# Altium project ADAS_ECU_revA.PrjPcb (part 2 of 6)

## Sheet JETSON_V2.SchDoc
size D; SheetNumber: 7; SheetTotal: 19
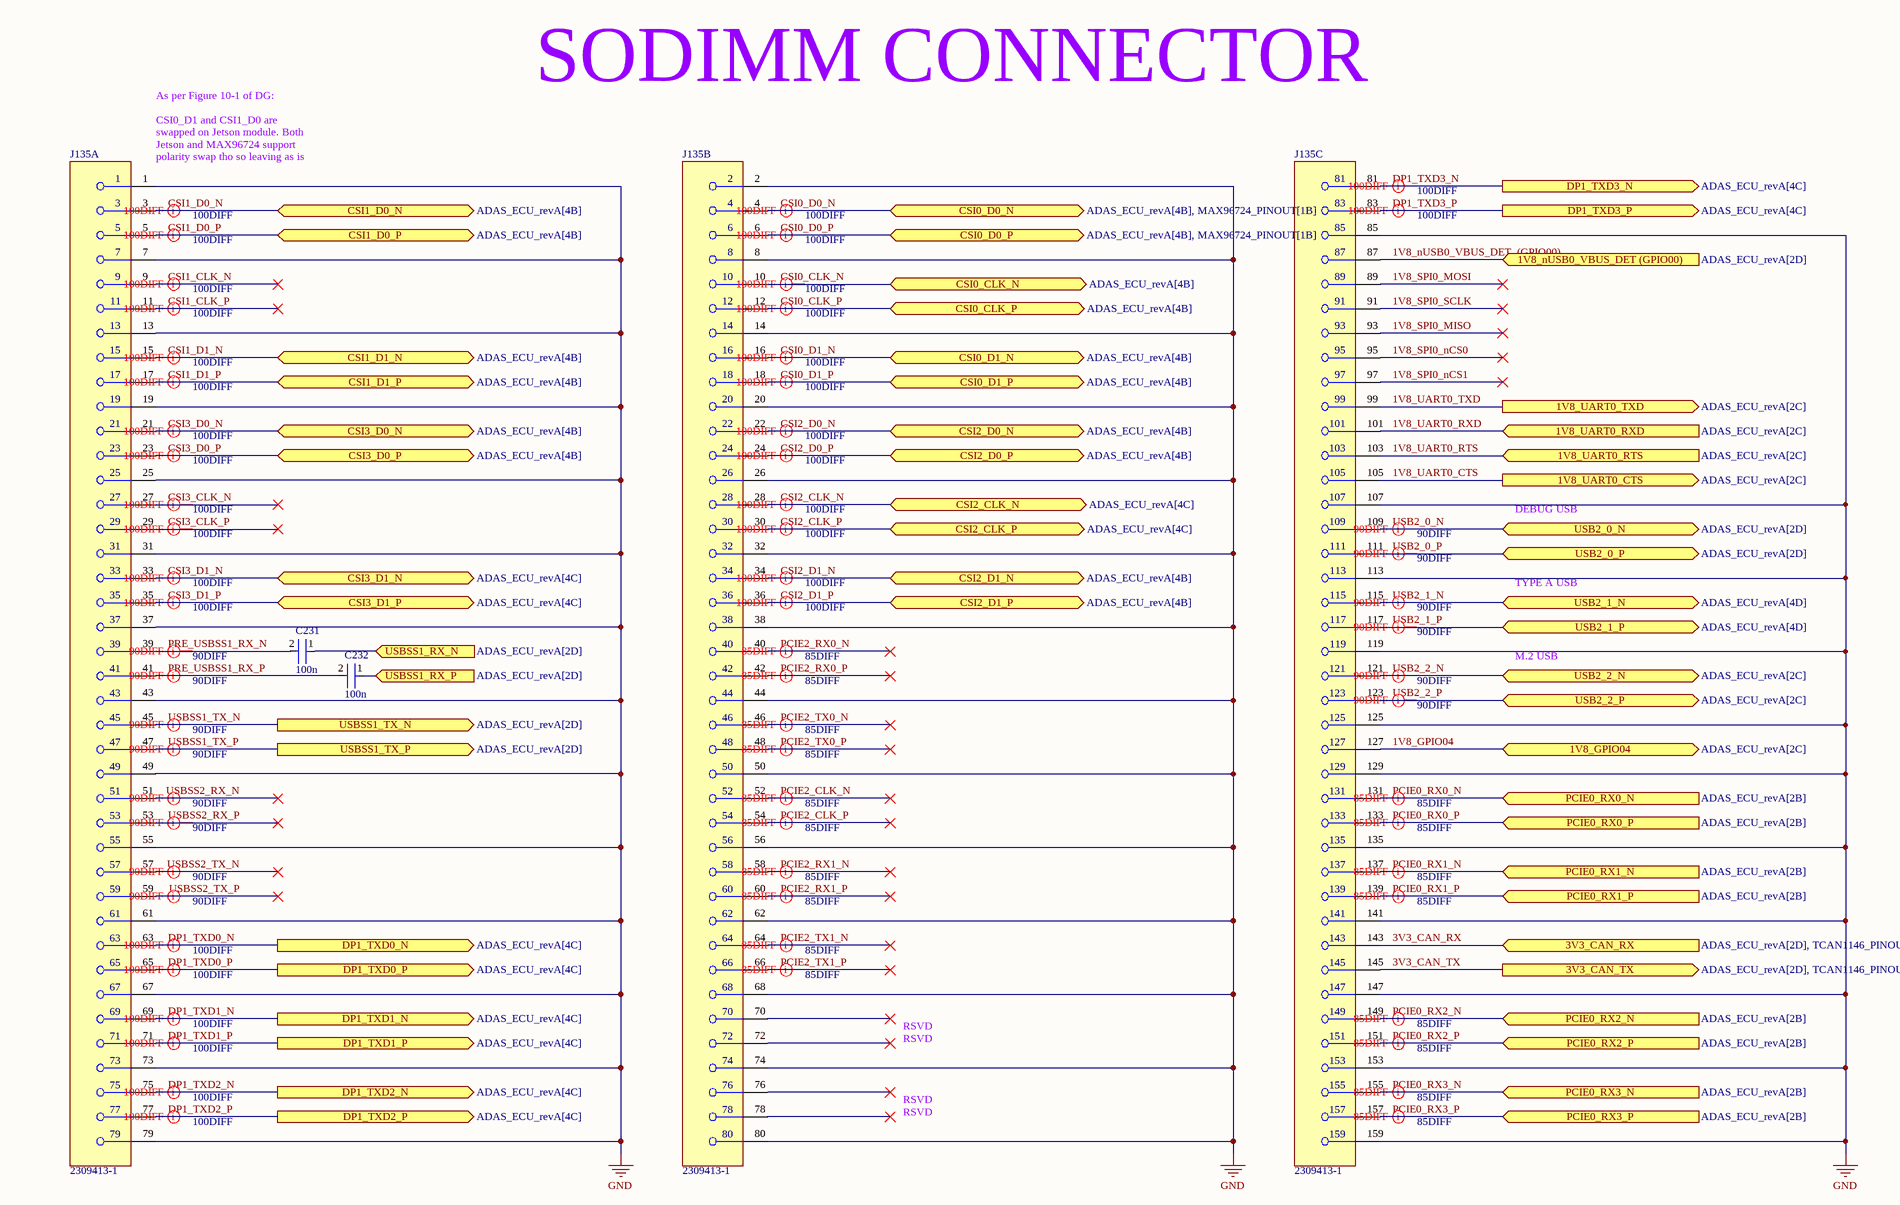
[diagram p12: JETSON_V2.SchDoc, top left]
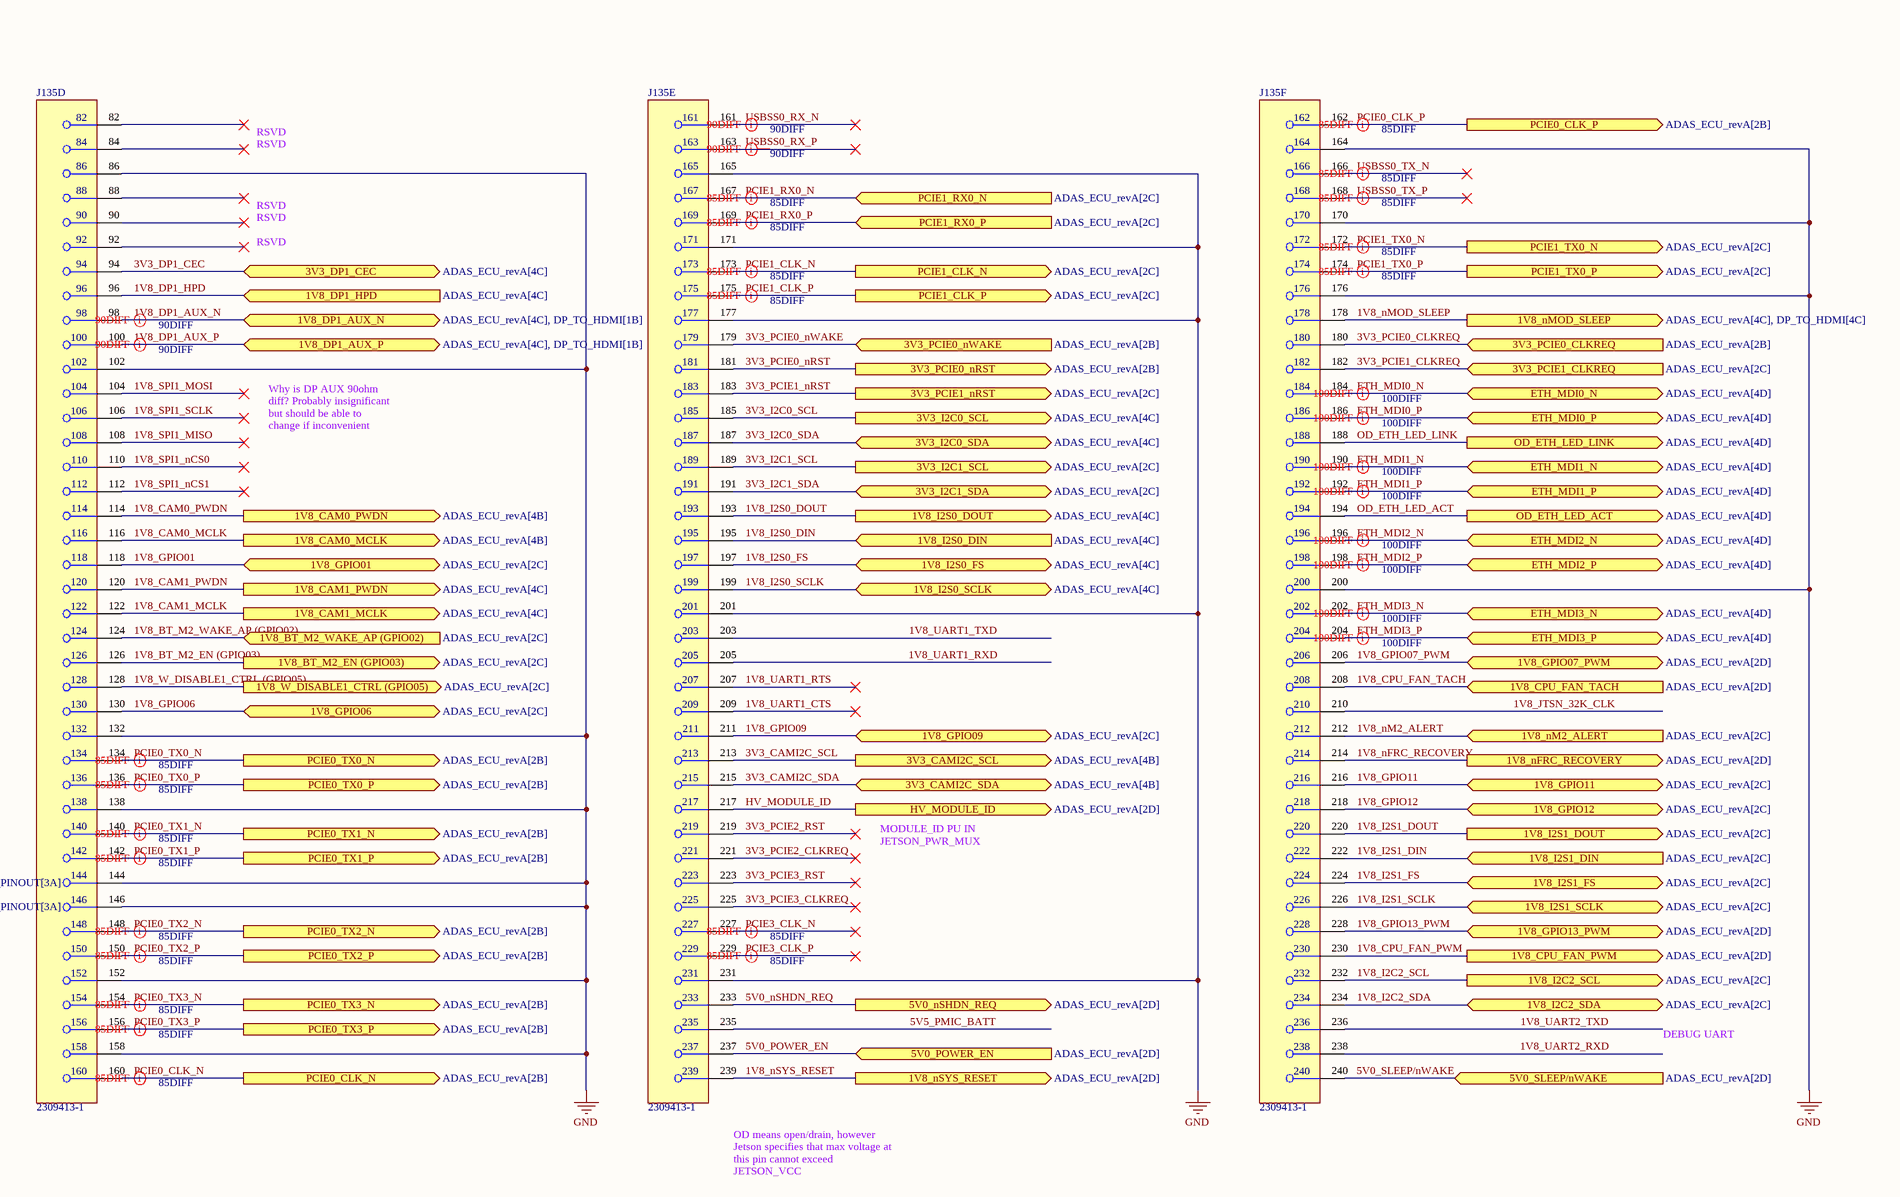
[diagram p13: JETSON_V2.SchDoc, top right]
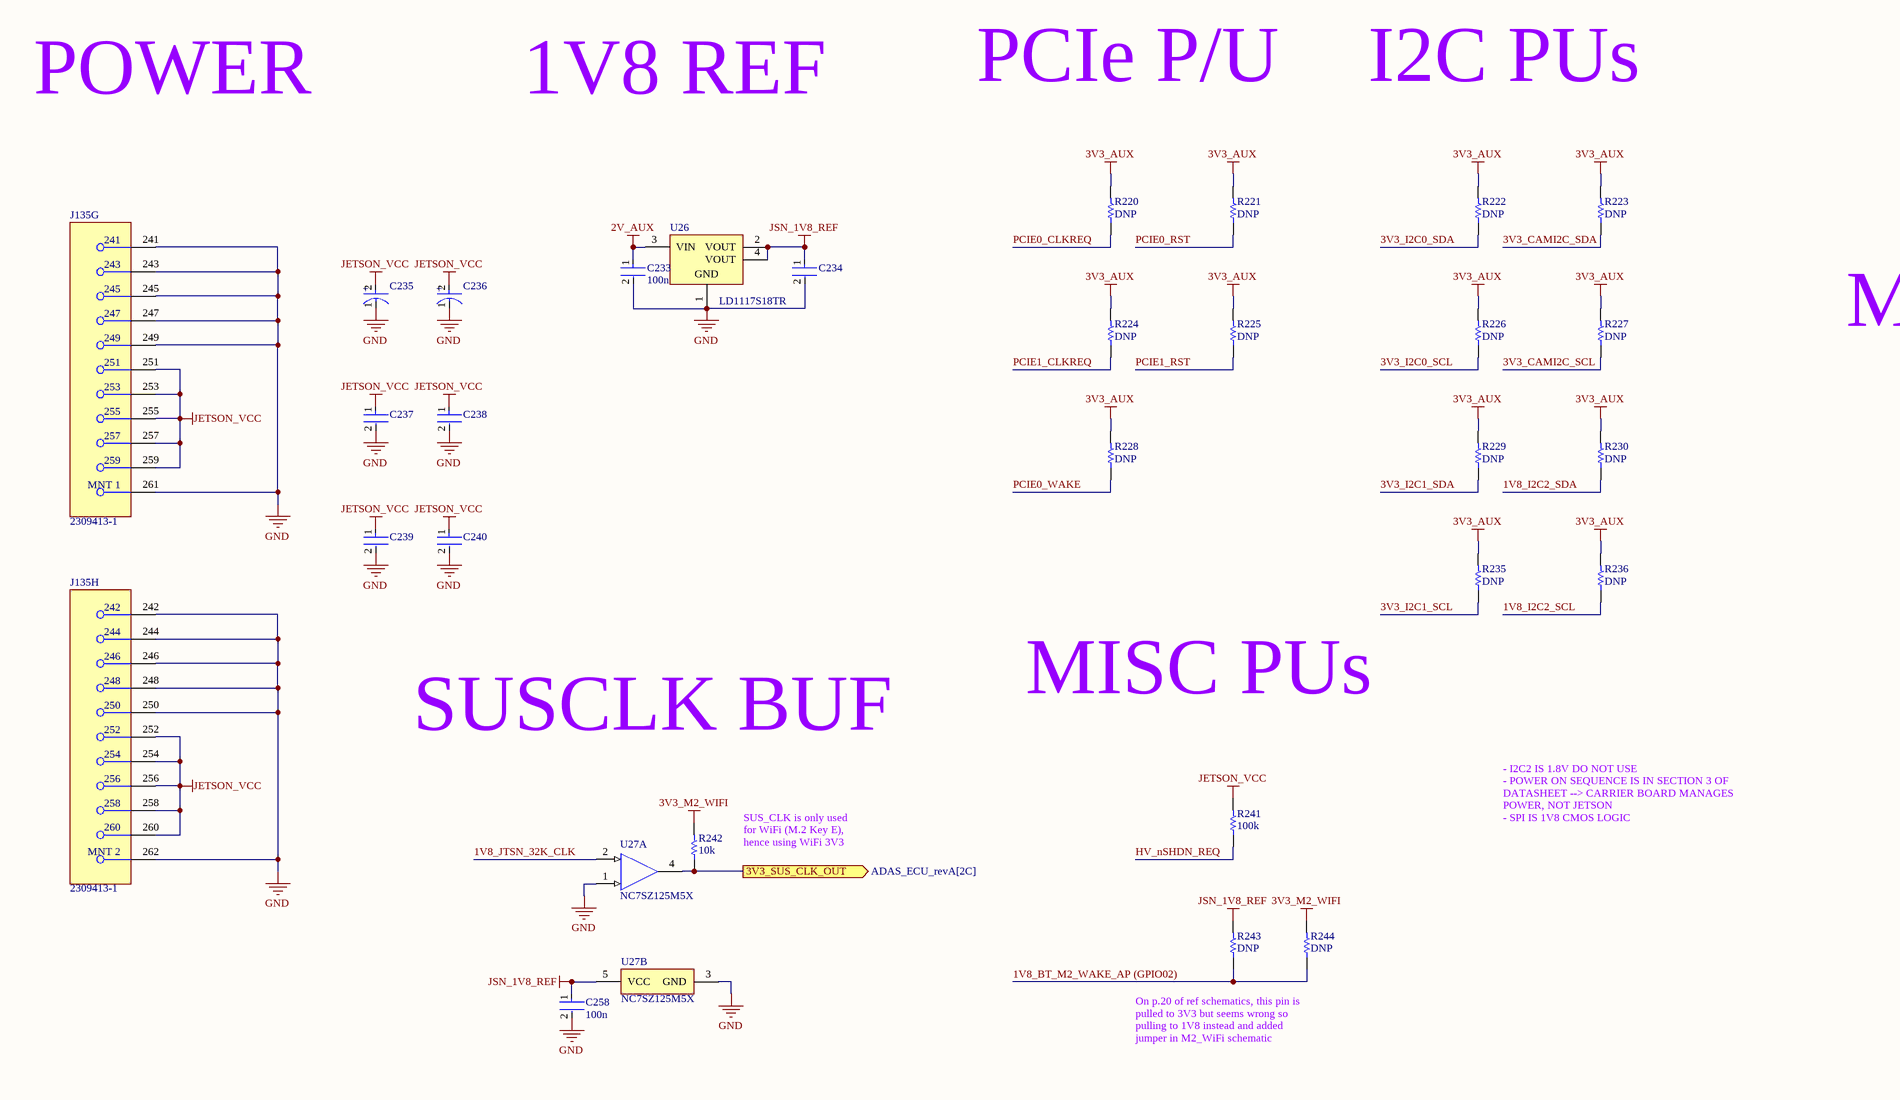
[diagram p14: JETSON_V2.SchDoc, bottom left]
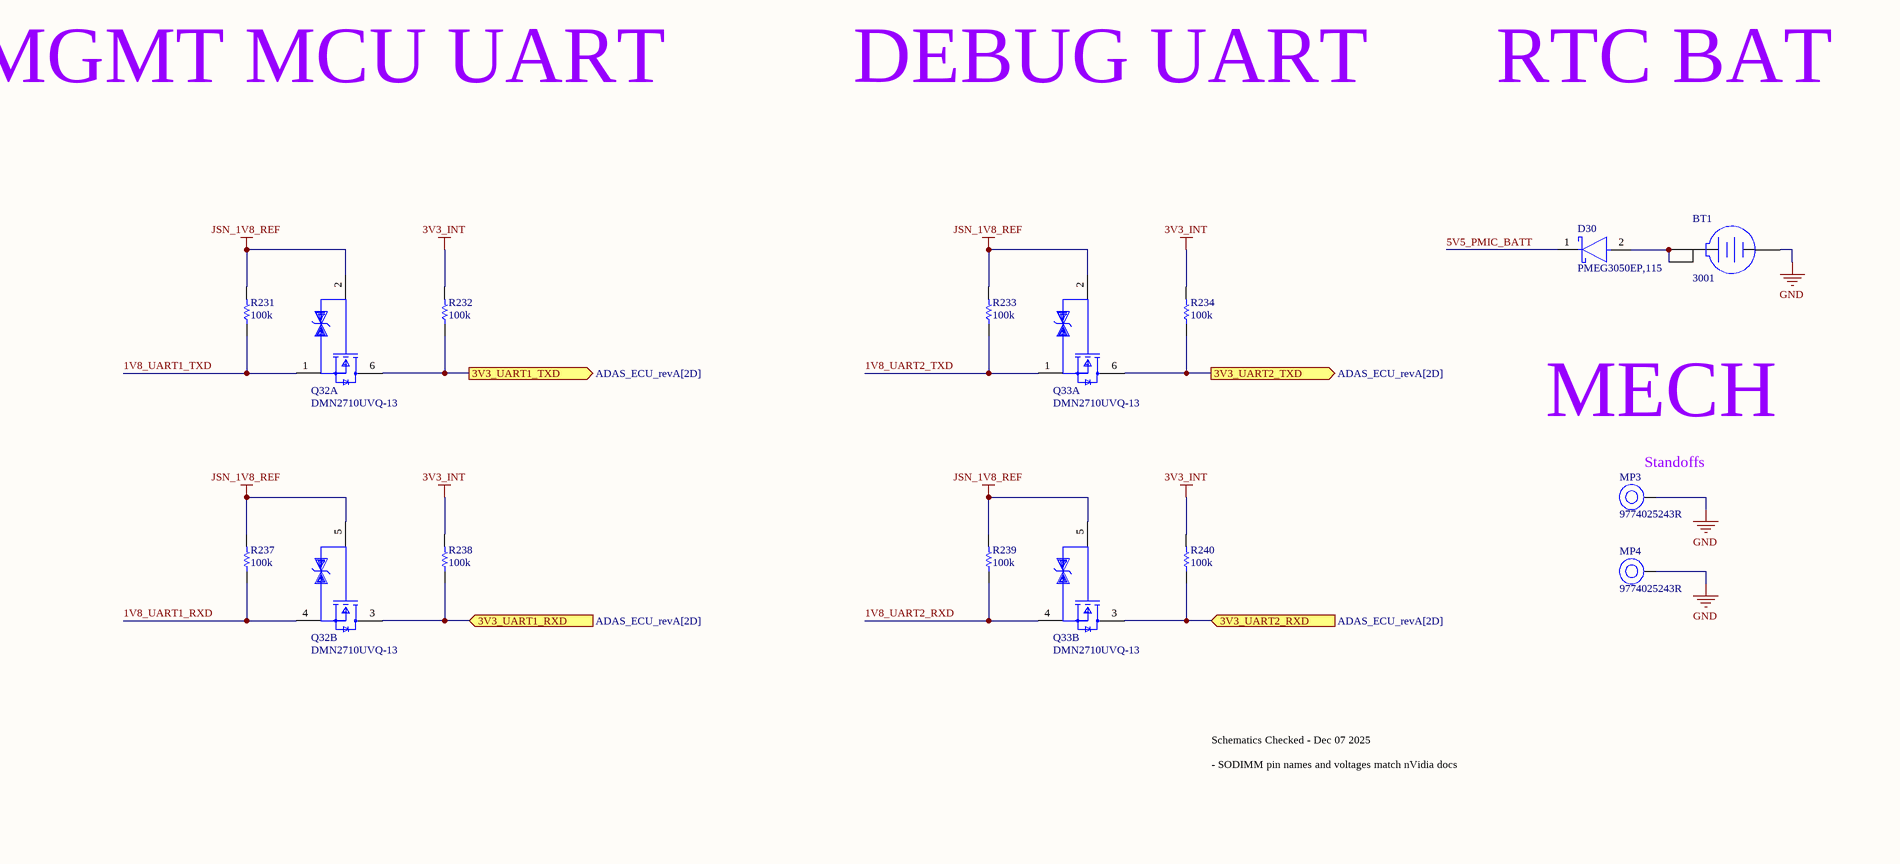
[diagram p15: JETSON_V2.SchDoc, bottom right]

### Parts
BT1  3001  [KSTN-3001_V]
C231  100n  [FP-0402-L_1_0_0_05-W_0_5-IPC_A]
C232  100n  [FP-0402-L_1_0_0_05-W_0_5-IPC_A]
C233  100n  [FP-0402-L_1_0_0_05-W_0_5-IPC_A]
C234  GRM188R60J106ME47D  [FP-GRM188-0_1-e0_2_0_55-IPC_A]  (value not drawn)
C235  T491X107K025AT  [FP-T491X107K025AT-MFG]  (value not drawn)
C236  T491X107K025AT  [FP-T491X107K025AT-MFG]  (value not drawn)
C237  12103D106KAT2A  [FP-1210-L_3_3_0_4-W_2_5_0-MFG]  (value not drawn)
C238  12103D106KAT2A  [FP-1210-L_3_3_0_4-W_2_5_0-MFG]  (value not drawn)
C239  12103D106KAT2A  [FP-1210-L_3_3_0_4-W_2_5_0-MFG]  (value not drawn)
C240  12103D106KAT2A  [FP-1210-L_3_3_0_4-W_2_5_0-MFG]  (value not drawn)
C258  100n  [FP-0402-L_1_0_0_05-W_0_5-IPC_A]
D30  PMEG3050EP,115  [FP-SOD128-MFG]
J135  2309413-1  [FP-2309413-1-MFG]  (parts A,B,C,D,E,F,G,H of 8)
MP3  9774025243R  [9774025243]
MP4  9774025243R  [9774025243]
Q32  DMN2710UVQ-13  [SOTFL50P162X60-6N]  (parts A,B of 2)
Q33  DMN2710UVQ-13  [SOTFL50P162X60-6N]  (parts A,B of 2)
R220  DNP  [R0603B]
R221  DNP  [R0603B]
R222  DNP  [R0603B]
R223  DNP  [R0603B]
R224  DNP  [R0603B]
R225  DNP  [R0603B]
R226  DNP  [R0603B]
R227  DNP  [R0603B]
R228  DNP  [R0603B]
R229  DNP  [R0603B]
R230  DNP  [R0603B]
R231  100k  [R0603B]
R232  100k  [R0603B]
R233  100k  [R0603B]
R234  100k  [R0603B]
R235  DNP  [R0603B]
R236  DNP  [R0603B]
R237  100k  [R0603B]
R238  100k  [R0603B]
R239  100k  [R0603B]
R240  100k  [R0603B]
R241  100k  [R0603B]
R242  10k  [R0603B]
R243  DNP  [R0603B]
R244  DNP  [R0603B]
U26  LD1117S18TR  [SOT-223_M]
U27  NC7SZ125M5X  [FAIR-SOT23-5_V]  (parts A,B of 2)

### Ports
1V8_BT_M2_EN (GPIO03) (out, see ADAS_ECU_revA[2C]), 1V8_BT_M2_WAKE_AP (GPIO02) (in, see ADAS_ECU_revA[2C]), 1V8_CAM0_MCLK (out, see ADAS_ECU_revA[4B]), 1V8_CAM0_PWDN (out, see ADAS_ECU_revA[4B]), 1V8_CAM1_MCLK (out, see ADAS_ECU_revA[4C]), 1V8_CAM1_PWDN (out, see ADAS_ECU_revA[4C]), 1V8_CPU_FAN_PWM (out, see ADAS_ECU_revA[2D]), 1V8_CPU_FAN_TACH (in, see ADAS_ECU_revA[2D]), 1V8_DP1_AUX_N (bidir, see ADAS_ECU_revA[4C], DP_TO_HDMI[1B]), 1V8_DP1_AUX_P (bidir, see ADAS_ECU_revA[4C], DP_TO_HDMI[1B]), 1V8_DP1_HPD (in, see ADAS_ECU_revA[4C]), 1V8_GPIO01 (bidir, see ADAS_ECU_revA[2C]), 1V8_GPIO04 (bidir, see ADAS_ECU_revA[2C]), 1V8_GPIO06 (bidir, see ADAS_ECU_revA[2C]), 1V8_GPIO07_PWM (bidir, see ADAS_ECU_revA[2D]), 1V8_GPIO09 (bidir, see ADAS_ECU_revA[2C]), 1V8_GPIO11 (bidir, see ADAS_ECU_revA[2C]), 1V8_GPIO12 (bidir, see ADAS_ECU_revA[2C]), 1V8_GPIO13_PWM (bidir, see ADAS_ECU_revA[2D]), 1V8_I2C2_SCL (out, see ADAS_ECU_revA[2C]), 1V8_I2C2_SDA (bidir, see ADAS_ECU_revA[2C]), 1V8_I2S0_DIN (in, see ADAS_ECU_revA[4C]), 1V8_I2S0_DOUT (out, see ADAS_ECU_revA[4C]), 1V8_I2S0_FS (bidir, see ADAS_ECU_revA[4C]), 1V8_I2S0_SCLK (bidir, see ADAS_ECU_revA[4C]), 1V8_I2S1_DIN (in, see ADAS_ECU_revA[2C]), 1V8_I2S1_DOUT (out, see ADAS_ECU_revA[2C]), 1V8_I2S1_FS (bidir, see ADAS_ECU_revA[2C]), 1V8_I2S1_SCLK (bidir, see ADAS_ECU_revA[2C]), 1V8_nFRC_RECOVERY (out, see ADAS_ECU_revA[2D]), 1V8_nM2_ALERT (in, see ADAS_ECU_revA[2C]), 1V8_nMOD_SLEEP (out, see ADAS_ECU_revA[4C], DP_TO_HDMI[4C]), 1V8_nSYS_RESET (out, see ADAS_ECU_revA[2D]), 1V8_nUSB0_VBUS_DET (GPIO00) (in, see ADAS_ECU_revA[2D]), 1V8_UART0_CTS (out, see ADAS_ECU_revA[2C]), 1V8_UART0_RTS (in, see ADAS_ECU_revA[2C]), 1V8_UART0_RXD (in, see ADAS_ECU_revA[2C]), 1V8_UART0_TXD (out, see ADAS_ECU_revA[2C]), 1V8_W_DISABLE1_CTRL (GPIO05) (out, see ADAS_ECU_revA[2C]), 3V3_CAMI2C_SCL (out, see ADAS_ECU_revA[4B]), 3V3_CAMI2C_SDA (bidir, see ADAS_ECU_revA[4B]), 3V3_CAN_RX (in, see ADAS_ECU_revA[2D], TCAN1146_PINOUT[3A]), 3V3_CAN_TX (out, see ADAS_ECU_revA[2D], TCAN1146_PINOUT[3A]), 3V3_DP1_CEC (bidir, see ADAS_ECU_revA[4C]), 3V3_I2C0_SCL (out, see ADAS_ECU_revA[4C]), 3V3_I2C0_SDA (bidir, see ADAS_ECU_revA[4C]), 3V3_I2C1_SCL (out, see ADAS_ECU_revA[2C]), 3V3_I2C1_SDA (bidir, see ADAS_ECU_revA[2C]), 3V3_PCIE0_CLKREQ (in, see ADAS_ECU_revA[2B]), 3V3_PCIE0_nRST (out, see ADAS_ECU_revA[2B]), 3V3_PCIE0_nWAKE (in, see ADAS_ECU_revA[2B]), 3V3_PCIE1_CLKREQ (in, see ADAS_ECU_revA[2C]), 3V3_PCIE1_nRST (out, see ADAS_ECU_revA[2C]), 3V3_SUS_CLK_OUT (out, see ADAS_ECU_revA[2C]), 3V3_UART1_RXD (in, see ADAS_ECU_revA[2D]), 3V3_UART1_TXD (out, see ADAS_ECU_revA[2D]), 3V3_UART2_RXD (in, see ADAS_ECU_revA[2D]), 3V3_UART2_TXD (out, see ADAS_ECU_revA[2D]), 5V0_nSHDN_REQ (out, see ADAS_ECU_revA[2D]), 5V0_POWER_EN (in, see ADAS_ECU_revA[2D]), 5V0_SLEEP/nWAKE (in, see ADAS_ECU_revA[2D]), CSI0_CLK_N (bidir, see ADAS_ECU_revA[4B]), CSI0_CLK_P (bidir, see ADAS_ECU_revA[4B]), CSI0_D0_N (bidir, see ADAS_ECU_revA[4B], MAX96724_PINOUT[1B]), CSI0_D0_P (bidir, see ADAS_ECU_revA[4B], MAX96724_PINOUT[1B]), CSI0_D1_N (bidir, see ADAS_ECU_revA[4B]), CSI0_D1_P (bidir, see ADAS_ECU_revA[4B]), CSI1_D0_N (bidir, see ADAS_ECU_revA[4B]), CSI1_D0_P (bidir, see ADAS_ECU_revA[4B]), CSI1_D1_N (bidir, see ADAS_ECU_revA[4B]), CSI1_D1_P (bidir, see ADAS_ECU_revA[4B]), CSI2_CLK_N (bidir, see ADAS_ECU_revA[4C]), CSI2_CLK_P (bidir, see ADAS_ECU_revA[4C]), CSI2_D0_N (bidir, see ADAS_ECU_revA[4B]), CSI2_D0_P (bidir, see ADAS_ECU_revA[4B]), CSI2_D1_N (bidir, see ADAS_ECU_revA[4B]), CSI2_D1_P (bidir, see ADAS_ECU_revA[4B]), CSI3_D0_N (bidir, see ADAS_ECU_revA[4B]), CSI3_D0_P (bidir, see ADAS_ECU_revA[4B]), CSI3_D1_N (bidir, see ADAS_ECU_revA[4C]), CSI3_D1_P (bidir, see ADAS_ECU_revA[4C]), DP1_TXD0_N (out, see ADAS_ECU_revA[4C]), DP1_TXD0_P (out, see ADAS_ECU_revA[4C]), DP1_TXD1_N (out, see ADAS_ECU_revA[4C]), DP1_TXD1_P (out, see ADAS_ECU_revA[4C]), DP1_TXD2_N (out, see ADAS_ECU_revA[4C]), DP1_TXD2_P (out, see ADAS_ECU_revA[4C]), DP1_TXD3_N (out, see ADAS_ECU_revA[4C]), DP1_TXD3_P (out, see ADAS_ECU_revA[4C]), ETH_MDI0_N (bidir, see ADAS_ECU_revA[4D]), ETH_MDI0_P (bidir, see ADAS_ECU_revA[4D]), ETH_MDI1_N (bidir, see ADAS_ECU_revA[4D]), ETH_MDI1_P (bidir, see ADAS_ECU_revA[4D]), ETH_MDI2_N (bidir, see ADAS_ECU_revA[4D]), ETH_MDI2_P (bidir, see ADAS_ECU_revA[4D]), ETH_MDI3_N (bidir, see ADAS_ECU_revA[4D]), ETH_MDI3_P (bidir, see ADAS_ECU_revA[4D]), HV_MODULE_ID (out, see ADAS_ECU_revA[2D]), OD_ETH_LED_ACT (out, see ADAS_ECU_revA[4D]), OD_ETH_LED_LINK (out, see ADAS_ECU_revA[4D]), PCIE0_CLK_N (out, see ADAS_ECU_revA[2B]), PCIE0_CLK_P (out, see ADAS_ECU_revA[2B]), PCIE0_RX0_N (in, see ADAS_ECU_revA[2B]), PCIE0_RX0_P (in, see ADAS_ECU_revA[2B]), PCIE0_RX1_N (in, see ADAS_ECU_revA[2B]), PCIE0_RX1_P (in, see ADAS_ECU_revA[2B]), PCIE0_RX2_N (in, see ADAS_ECU_revA[2B]), PCIE0_RX2_P (in, see ADAS_ECU_revA[2B]), PCIE0_RX3_N (in, see ADAS_ECU_revA[2B]), PCIE0_RX3_P (in, see ADAS_ECU_revA[2B]), PCIE0_TX0_N (out, see ADAS_ECU_revA[2B]), PCIE0_TX0_P (out, see ADAS_ECU_revA[2B]), PCIE0_TX1_N (out, see ADAS_ECU_revA[2B]), PCIE0_TX1_P (out, see ADAS_ECU_revA[2B]), PCIE0_TX2_N (out, see ADAS_ECU_revA[2B]), PCIE0_TX2_P (out, see ADAS_ECU_revA[2B]), PCIE0_TX3_N (out, see ADAS_ECU_revA[2B]), PCIE0_TX3_P (out, see ADAS_ECU_revA[2B]), PCIE1_CLK_N (out, see ADAS_ECU_revA[2C]), PCIE1_CLK_P (out, see ADAS_ECU_revA[2C]), PCIE1_RX0_N (in, see ADAS_ECU_revA[2C]), PCIE1_RX0_P (in, see ADAS_ECU_revA[2C]), PCIE1_TX0_N (out, see ADAS_ECU_revA[2C]), PCIE1_TX0_P (out, see ADAS_ECU_revA[2C]), USB2_0_N (bidir, see ADAS_ECU_revA[2D]), USB2_0_P (bidir, see ADAS_ECU_revA[2D]), USB2_1_N (bidir, see ADAS_ECU_revA[4D]), USB2_1_P (bidir, see ADAS_ECU_revA[4D]), USB2_2_N (bidir, see ADAS_ECU_revA[2C]), USB2_2_P (bidir, see ADAS_ECU_revA[2C]), USBSS1_RX_N (in, see ADAS_ECU_revA[2D]), USBSS1_RX_P (in, see ADAS_ECU_revA[2D]), USBSS1_TX_N (out, see ADAS_ECU_revA[2D]), USBSS1_TX_P (out, see ADAS_ECU_revA[2D])

### Nets
2V_AUX: C233.1 U26.3(VIN)
3V3_AUX: R220.2 R221.2 R222.2 R223.2 R224.2 R225.2 R226.2 R227.2 R228.2 R229.2 R230.2 R235.2 R236.2
3V3_INT: R232.2 R234.2 R238.2 R240.2
3V3_M2_WIFI: R242.2 R244.2
GND: BT1.3(-) C233.2 C234.2 C235.1(C) C236.1(C) C237.2 C238.2 C239.2 C240.2 C258.2 J135.1 J135.2 J135.7 J135.8 J135.13 J135.14 J135.19 J135.20 J135.25 J135.26 J135.31 J135.32 J135.37 J135.38 J135.43 J135.44 J135.49 J135.50 J135.55 J135.56 J135.61 J135.62 J135.67 J135.68 J135.73 J135.74 J135.79 J135.80 J135.85 J135.86 J135.102 J135.107 J135.113 J135.119 J135.125 J135.129 J135.132 J135.135 J135.138 J135.141 J135.144 J135.146 J135.147 J135.152 J135.153 J135.158 J135.159 J135.164 J135.165 J135.170 J135.171 J135.176 J135.177 J135.200 J135.201 J135.231 J135.241 J135.242 J135.243 J135.244 J135.245 J135.246 J135.247 J135.248 J135.249 J135.250 J135.261(MNT_1) J135.262(MNT_2) MP3.1 MP4.1 U26.1(GND) U27.1(~{OE}) U27.3(GND)
JETSON_VCC: C235.2(A) C236.2(A) C237.1 C238.1 C239.1 C240.1 J135.251 J135.252 J135.253 J135.254 J135.255 J135.256 J135.257 J135.258 J135.259 J135.260 R241.2
JSN_1V8_REF: C234.1 C258.1 Q32.2(Gate1) Q32.5(Gate2) Q33.2(Gate1) Q33.5(Gate2) R231.2 R233.2 R237.2 R239.2 R243.2 U26.2(VOUT) U26.4(VOUT) U27.5(VCC)
1V8_BT_M2_EN (GPIO03): J135.126 ; port 1V8_BT_M2_EN (GPIO03)
1V8_BT_M2_WAKE_AP (GPIO02): J135.124 R243.1 R244.1 ; port 1V8_BT_M2_WAKE_AP (GPIO02)
1V8_CAM0_MCLK: J135.116 ; port 1V8_CAM0_MCLK
1V8_CAM0_PWDN: J135.114 ; port 1V8_CAM0_PWDN
1V8_CAM1_MCLK: J135.122 ; port 1V8_CAM1_MCLK
1V8_CAM1_PWDN: J135.120 ; port 1V8_CAM1_PWDN
1V8_CPU_FAN_PWM: J135.230 ; port 1V8_CPU_FAN_PWM
1V8_CPU_FAN_TACH: J135.208 ; port 1V8_CPU_FAN_TACH
1V8_DP1_AUX_N: J135.98 ; port 1V8_DP1_AUX_N
1V8_DP1_AUX_P: J135.100 ; port 1V8_DP1_AUX_P
1V8_DP1_HPD: J135.96 ; port 1V8_DP1_HPD
1V8_GPIO01: J135.118 ; port 1V8_GPIO01
1V8_GPIO04: J135.127 ; port 1V8_GPIO04
1V8_GPIO06: J135.130 ; port 1V8_GPIO06
1V8_GPIO07_PWM: J135.206 ; port 1V8_GPIO07_PWM
1V8_GPIO09: J135.211 ; port 1V8_GPIO09
1V8_GPIO11: J135.216 ; port 1V8_GPIO11
1V8_GPIO12: J135.218 ; port 1V8_GPIO12
1V8_GPIO13_PWM: J135.228 ; port 1V8_GPIO13_PWM
1V8_I2C2_SCL: J135.232 R236.1 ; port 1V8_I2C2_SCL
1V8_I2C2_SDA: J135.234 R230.1 ; port 1V8_I2C2_SDA
1V8_I2S0_DIN: J135.195 ; port 1V8_I2S0_DIN
1V8_I2S0_DOUT: J135.193 ; port 1V8_I2S0_DOUT
1V8_I2S0_FS: J135.197 ; port 1V8_I2S0_FS
1V8_I2S0_SCLK: J135.199 ; port 1V8_I2S0_SCLK
1V8_I2S1_DIN: J135.222 ; port 1V8_I2S1_DIN
1V8_I2S1_DOUT: J135.220 ; port 1V8_I2S1_DOUT
1V8_I2S1_FS: J135.224 ; port 1V8_I2S1_FS
1V8_I2S1_SCLK: J135.226 ; port 1V8_I2S1_SCLK
1V8_JTSN_32K_CLK: J135.210 U27.2(A)
1V8_nFRC_RECOVERY: J135.214 ; port 1V8_nFRC_RECOVERY
1V8_nM2_ALERT: J135.212 ; port 1V8_nM2_ALERT
1V8_nMOD_SLEEP: J135.178 ; port 1V8_nMOD_SLEEP
1V8_nSYS_RESET: J135.239 ; port 1V8_nSYS_RESET
1V8_nUSB0_VBUS_DET  (GPIO00): J135.87 ; port 1V8_nUSB0_VBUS_DET (GPIO00)
1V8_SPI0_MISO: J135.93
1V8_SPI0_MOSI: J135.89
1V8_SPI0_nCS0: J135.95
1V8_SPI0_nCS1: J135.97
1V8_SPI0_SCLK: J135.91
1V8_SPI1_MISO: J135.108
1V8_SPI1_MOSI: J135.104
1V8_SPI1_nCS0: J135.110
1V8_SPI1_nCS1: J135.112
1V8_SPI1_SCLK: J135.106
1V8_UART0_CTS: J135.105 ; port 1V8_UART0_CTS
1V8_UART0_RTS: J135.103 ; port 1V8_UART0_RTS
1V8_UART0_RXD: J135.101 ; port 1V8_UART0_RXD
1V8_UART0_TXD: J135.99 ; port 1V8_UART0_TXD
1V8_UART1_CTS: J135.209
1V8_UART1_RTS: J135.207
1V8_UART1_RXD: J135.205 Q32.4(Source2) R237.1
1V8_UART1_TXD: J135.203 Q32.1(Source1) R231.1
1V8_UART2_RXD: J135.238 Q33.4(Source2) R239.1
1V8_UART2_TXD: J135.236 Q33.1(Source1) R233.1
1V8_W_DISABLE1_CTRL (GPIO05): J135.128 ; port 1V8_W_DISABLE1_CTRL (GPIO05)
3V3_CAMI2C_SCL: J135.213 R227.1 ; port 3V3_CAMI2C_SCL
3V3_CAMI2C_SDA: J135.215 R223.1 ; port 3V3_CAMI2C_SDA
3V3_CAN_RX: J135.143 ; port 3V3_CAN_RX
3V3_CAN_TX: J135.145 ; port 3V3_CAN_TX
3V3_DP1_CEC: J135.94 ; port 3V3_DP1_CEC
3V3_I2C0_SCL: J135.185 R226.1 ; port 3V3_I2C0_SCL
3V3_I2C0_SDA: J135.187 R222.1 ; port 3V3_I2C0_SDA
3V3_I2C1_SCL: J135.189 R235.1 ; port 3V3_I2C1_SCL
3V3_I2C1_SDA: J135.191 R229.1 ; port 3V3_I2C1_SDA
3V3_PCIE0_CLKREQ: J135.180 ; port 3V3_PCIE0_CLKREQ
3V3_PCIE0_nRST: J135.181 ; port 3V3_PCIE0_nRST
3V3_PCIE0_nWAKE: J135.179 ; port 3V3_PCIE0_nWAKE
3V3_PCIE1_CLKREQ: J135.182 ; port 3V3_PCIE1_CLKREQ
3V3_PCIE1_nRST: J135.183 ; port 3V3_PCIE1_nRST
3V3_PCIE2_CLKREQ: J135.221
3V3_PCIE2_RST: J135.219
3V3_PCIE3_CLKREQ: J135.225
3V3_PCIE3_RST: J135.223
3V3_UART1_RXD: Q32.3(Drain2) R238.1 ; port 3V3_UART1_RXD
3V3_UART1_TXD: Q32.6(Drain1) R232.1 ; port 3V3_UART1_TXD
3V3_UART2_RXD: Q33.3(Drain2) R240.1 ; port 3V3_UART2_RXD
3V3_UART2_TXD: Q33.6(Drain1) R234.1 ; port 3V3_UART2_TXD
5V0_nSHDN_REQ: J135.233 ; port 5V0_nSHDN_REQ
5V0_POWER_EN: J135.237 ; port 5V0_POWER_EN
5V0_SLEEP/nWAKE: J135.240 ; port 5V0_SLEEP/nWAKE
5V5_PMIC_BATT: D30.1(C) J135.235
CSI0_CLK_N: J135.10 ; port CSI0_CLK_N
CSI0_CLK_P: J135.12 ; port CSI0_CLK_P
CSI0_D0_N: J135.4 ; port CSI0_D0_N
CSI0_D0_P: J135.6 ; port CSI0_D0_P
CSI0_D1_N: J135.16 ; port CSI0_D1_N
CSI0_D1_P: J135.18 ; port CSI0_D1_P
CSI1_CLK_N: J135.9
CSI1_CLK_P: J135.11
CSI1_D0_N: J135.3 ; port CSI1_D0_N
CSI1_D0_P: J135.5 ; port CSI1_D0_P
CSI1_D1_N: J135.15 ; port CSI1_D1_N
CSI1_D1_P: J135.17 ; port CSI1_D1_P
CSI2_CLK_N: J135.28 ; port CSI2_CLK_N
CSI2_CLK_P: J135.30 ; port CSI2_CLK_P
CSI2_D0_N: J135.22 ; port CSI2_D0_N
CSI2_D0_P: J135.24 ; port CSI2_D0_P
CSI2_D1_N: J135.34 ; port CSI2_D1_N
CSI2_D1_P: J135.36 ; port CSI2_D1_P
CSI3_CLK_N: J135.27
CSI3_CLK_P: J135.29
CSI3_D0_N: J135.21 ; port CSI3_D0_N
CSI3_D0_P: J135.23 ; port CSI3_D0_P
CSI3_D1_N: J135.33 ; port CSI3_D1_N
CSI3_D1_P: J135.35 ; port CSI3_D1_P
DP1_TXD0_N: J135.63 ; port DP1_TXD0_N
DP1_TXD0_P: J135.65 ; port DP1_TXD0_P
DP1_TXD1_N: J135.69 ; port DP1_TXD1_N
DP1_TXD1_P: J135.71 ; port DP1_TXD1_P
DP1_TXD2_N: J135.75 ; port DP1_TXD2_N
DP1_TXD2_P: J135.77 ; port DP1_TXD2_P
DP1_TXD3_N: J135.81 ; port DP1_TXD3_N
DP1_TXD3_P: J135.83 ; port DP1_TXD3_P
ETH_MDI0_N: J135.184 ; port ETH_MDI0_N
ETH_MDI0_P: J135.186 ; port ETH_MDI0_P
ETH_MDI1_N: J135.190 ; port ETH_MDI1_N
ETH_MDI1_P: J135.192 ; port ETH_MDI1_P
ETH_MDI2_N: J135.196 ; port ETH_MDI2_N
ETH_MDI2_P: J135.198 ; port ETH_MDI2_P
ETH_MDI3_N: J135.202 ; port ETH_MDI3_N
ETH_MDI3_P: J135.204 ; port ETH_MDI3_P
HV_MODULE_ID: J135.217 ; port HV_MODULE_ID  [project net 3V3_MODULE_ID]
HV_nSHDN_REQ: R241.1
OD_ETH_LED_ACT: J135.194 ; port OD_ETH_LED_ACT
OD_ETH_LED_LINK: J135.188 ; port OD_ETH_LED_LINK
PCIE0_CLK_N: J135.160 ; port PCIE0_CLK_N
PCIE0_CLK_P: J135.162 ; port PCIE0_CLK_P
PCIE0_CLKREQ: R220.1
PCIE0_RST: R221.1
PCIE0_RX0_N: J135.131 ; port PCIE0_RX0_N
PCIE0_RX0_P: J135.133 ; port PCIE0_RX0_P
PCIE0_RX1_N: J135.137 ; port PCIE0_RX1_N
PCIE0_RX1_P: J135.139 ; port PCIE0_RX1_P
PCIE0_RX2_N: J135.149 ; port PCIE0_RX2_N
PCIE0_RX2_P: J135.151 ; port PCIE0_RX2_P
PCIE0_RX3_N: J135.155 ; port PCIE0_RX3_N
PCIE0_RX3_P: J135.157 ; port PCIE0_RX3_P
PCIE0_TX0_N: J135.134 ; port PCIE0_TX0_N
PCIE0_TX0_P: J135.136 ; port PCIE0_TX0_P
PCIE0_TX1_N: J135.140 ; port PCIE0_TX1_N
PCIE0_TX1_P: J135.142 ; port PCIE0_TX1_P
PCIE0_TX2_N: J135.148 ; port PCIE0_TX2_N
PCIE0_TX2_P: J135.150 ; port PCIE0_TX2_P
PCIE0_TX3_N: J135.154 ; port PCIE0_TX3_N
PCIE0_TX3_P: J135.156 ; port PCIE0_TX3_P
PCIE0_WAKE: R228.1
PCIE1_CLK_N: J135.173 ; port PCIE1_CLK_N
PCIE1_CLK_P: J135.175 ; port PCIE1_CLK_P
PCIE1_CLKREQ: R224.1
PCIE1_RST: R225.1
PCIE1_RX0_N: J135.167 ; port PCIE1_RX0_N
PCIE1_RX0_P: J135.169 ; port PCIE1_RX0_P
PCIE1_TX0_N: J135.172 ; port PCIE1_TX0_N
PCIE1_TX0_P: J135.174 ; port PCIE1_TX0_P
PCIE2_CLK_N: J135.52
PCIE2_CLK_P: J135.54
PCIE2_RX0_N: J135.40
PCIE2_RX0_P: J135.42
PCIE2_RX1_N: J135.58
PCIE2_RX1_P: J135.60
PCIE2_TX0_N: J135.46
PCIE2_TX0_P: J135.48
PCIE2_TX1_N: J135.64
PCIE2_TX1_P: J135.66
PCIE3_CLK_N: J135.227
PCIE3_CLK_P: J135.229
PRE_USBSS1_RX_N: C231.2 J135.39
PRE_USBSS1_RX_P: C232.2 J135.41
USB2_0_N: J135.109 ; port USB2_0_N
USB2_0_P: J135.111 ; port USB2_0_P
USB2_1_N: J135.115 ; port USB2_1_N
USB2_1_P: J135.117 ; port USB2_1_P
USB2_2_N: J135.121 ; port USB2_2_N
USB2_2_P: J135.123 ; port USB2_2_P
USBSS0_RX_N: J135.161
USBSS0_RX_P: J135.163
USBSS0_TX_N: J135.166
USBSS0_TX_P: J135.168
USBSS1_RX_N: C231.1 ; port USBSS1_RX_N
USBSS1_RX_P: C232.1 ; port USBSS1_RX_P
USBSS1_TX_N: J135.45 ; port USBSS1_TX_N
USBSS1_TX_P: J135.47 ; port USBSS1_TX_P
USBSS2_RX_N: J135.51
USBSS2_RX_P: J135.53
USBSS2_TX_N: J135.57
USBSS2_TX_P: J135.59
NetBT1_1: BT1.1(+) BT1.2(+) D30.2(A)
NetJ14_50: R242.1 U27.4(Y) ; port 3V3_SUS_CLK_OUT

Not connected (* = marked no-connect by the designer): J135 70* 72* 76* 78* 82* 84* 88* 90* 92*

### Layout directives
differential pair; differential pair class 85DIFF: PCIE0_CLK_N, PCIE0_CLK_P, PCIE0_RX0_N, PCIE0_RX0_P, PCIE0_RX1_N, PCIE0_RX1_P, PCIE0_RX2_N, PCIE0_RX2_P, PCIE0_RX3_N, PCIE0_RX3_P, PCIE0_TX0_N, PCIE0_TX0_P, PCIE0_TX1_N, PCIE0_TX1_P, PCIE0_TX2_N, PCIE0_TX2_P, PCIE0_TX3_N, PCIE0_TX3_P, PCIE1_CLK_N, PCIE1_CLK_P, PCIE1_RX0_N, PCIE1_RX0_P, PCIE1_TX0_N, PCIE1_TX0_P, PCIE2_CLK_N, PCIE2_CLK_P, PCIE2_RX0_N, PCIE2_RX0_P, PCIE2_RX1_N, PCIE2_RX1_P, PCIE2_TX0_N, PCIE2_TX0_P, PCIE2_TX1_N, PCIE2_TX1_P, PCIE3_CLK_N, PCIE3_CLK_P, USBSS0_TX_N, USBSS0_TX_P
differential pair; differential pair class 100DIFF: CSI0_CLK_N, CSI0_CLK_P, CSI0_D0_N, CSI0_D0_P, CSI0_D1_N, CSI0_D1_P, CSI1_CLK_N, CSI1_CLK_P, CSI1_D0_N, CSI1_D0_P, CSI1_D1_N, CSI1_D1_P, CSI2_CLK_N, CSI2_CLK_P, CSI2_D0_N, CSI2_D0_P, CSI2_D1_N, CSI2_D1_P, CSI3_CLK_N, CSI3_CLK_P, CSI3_D0_N, CSI3_D0_P, CSI3_D1_N, CSI3_D1_P, DP1_TXD0_N, DP1_TXD0_P, DP1_TXD1_N, DP1_TXD1_P, DP1_TXD2_N, DP1_TXD2_P, DP1_TXD3_N, DP1_TXD3_P, ETH_MDI0_N, ETH_MDI0_P, ETH_MDI1_N, ETH_MDI1_P, ETH_MDI2_N, ETH_MDI2_P, ETH_MDI3_N, ETH_MDI3_P
differential pair; differential pair class 90DIFF: 1V8_DP1_AUX_N, 1V8_DP1_AUX_P, PRE_USBSS1_RX_N, PRE_USBSS1_RX_P, USB2_0_N, USB2_0_P, USB2_1_N, USB2_1_P, USB2_2_N, USB2_2_P, USBSS0_RX_N, USBSS0_RX_P, USBSS1_TX_N, USBSS1_TX_P, USBSS2_RX_N, USBSS2_RX_P, USBSS2_TX_N, USBSS2_TX_P

### Notes on the sheet
- SODIMM CONNECTOR
- (near J135) As per Figure 10-1 of DG:
  CSI0_D1 and CSI1_D0 are swapped on Jetson module. Both Jetson and MAX96724 support polarity swap tho so leaving as is
- RSVD
  RSVD
- RSVD
- DEBUG USB
- Why is DP AUX 90ohm diff? Probably insignificant but should be able to change if inconvenient
- TYPE A USB
- M.2 USB
- MODULE_ID PU IN JETSON_PWR_MUX
- DEBUG UART
- OD means open/drain, however Jetson specifies that max voltage at this pin cannot exceed JETSON_VCC
- POWER
- 1V8 REF
- PCIe P/U
- I2C PUs
- MGMT MCU UART
- RTC BAT
- MECH
- SUSCLK BUF
- MISC PUs
- (near MP3) Standoffs
- - I2C2 IS 1.8V DO NOT USE
  - POWER ON SEQUENCE IS IN SECTION 3 OF DATASHEET --> CARRIER BOARD MANAGES POWER, NOT JETSON
  - SPI IS 1V8 CMOS LOGIC
- SUS_CLK is only used for WiFi (M.2 Key E), hence using WiFi 3V3
- On p.20 of ref schematics, this pin is pulled to 3V3 but seems wrong so pulling to 1V8 instead and added jumper in M2_WiFi schematic
- Schematics Checked - Dec 07 2025
  - SODIMM pin names and voltages match nVidia docs
- (in symbol CMP-2000-07204-2) +

### Library data of the parts
BT1 = CMP-2000-05463-1: Holder Battery Coin, 12 mm, 2-Pin THD, RoHS; Manufacturer: Keystone; Package Reference: 3001; Package Description: 2-Pin Through Hole Device, Body 13.21 x 12.07 mm; Datasheet Version: Rev. H, 09/2006; Datasheet URL: https://datasheet.ciiva.com/3/3001-3954.pdf; Mounting Technology: ThroughHole; Manufacturer URL: http://www.keyelco.com/
C231-C233 C258 = CMP-001-00058-1: LARGE PADS, 0402 CAP, CHANGE COMMENT TO MATCH REAL P/N; Capacitor Type: Ceramic; Min Operating Temperature: -55°C; Mounting Technology: Surface Mount; Pins: 2; Case/Package: 0402; RoHS Compliant: Yes; Max Operating Temperature: 85°C
C234 = CMP-2006-02792-2: Chip Multilayer Ceramic Capacitors for General Purpose, 0603, 10uF, X5R, 15%, 20%, 6.3V; Packaging: Tape and Reel; Voltage Rating (DC): 6.3V; Width: 0.031inch; Termination: SMD/SMT; Dielectric: X5R; Package Quantity: 4000; Voltage Rating: 6.3V; Capacitance: 10uF; Case/Package: 0603; Min Operating Temperature: -55°C; Voltage: 6.3V; Length: 1.6mm; Thickness: 0.035inch; Lead Free: Lead Free; Depth: 0.8mm; Case Code (Imperial): 0603; Max Operating Temperature: 85°C; Material: Ceramic; Height: 0.8mm; Tolerance: 20%; Mount: Surface Mount; REACH SVHC: No SVHC; Radiation Hardening: No; Case Code (Metric): 1608
C235 C236 = CMP-2000-07204-2: CAP TANT 100UF 10% 25V 2917; Leakage Current: 25uA; Ripple Current: 742mA; Polarity: Polar; Dissipation Factor: 8%; Life (Hours): 2000Hour; Dielectric Material: Tantalum; ESR (Equivalent Series Resistance): 300mR; Length: 7.3mm; RoHS Compliant: No; Failure Rate: 0.001%; REACH SVHC: No SVHC; Tolerance: 10%; Mount: Surface Mount; Height - Seated (Max): 0.169inch; Features: General Purpose; Height: 4mm; Package Quantity: 1; Case Code (Metric): 7343; Max Operating Temperature: 125°C; Number of Pins: 2; Radiation Hardening: No; Lead Free: Lead Free; Capacitance: 100uF; Termination: SMD/SMT; Voltage Rating: 25V; Series: T491; Depth: 4.3mm; Construction: Flat; Case/Package: 2917; Min Operating Temperature: -55°C; Voltage Rating (DC): 25V; Width: 4.3mm; Packaging: Tape and Reel; Case Code (Imperial): 2917; Voltage: 25V
C237-C240 = CMP-2000-05477-2: General Purpose Ceramic Capacitor, 1210, 10uF, 10%, X5R, 15%, 25V; Lead Free: Lead Free; Max Operating Temperature: 85°C; REACH SVHC: No SVHC; Depth: 2.5mm; Packaging: Tape and Reel; Min Operating Temperature: -55°C; Height: 2.29mm; Construction: Flat; Case Code (Imperial): 1210; Radiation Hardening: No; Voltage: 25V; Case/Package: 1210; Series: -; Dielectric: X5R; Length: 3.2mm; Thickness: 0.11inch; Package Quantity: 1; Termination: SMD/SMT; Case Code (Metric): 3225; Voltage Rating (DC): 25V; Voltage Rating: 25V; Contact Plating: Tin; RoHS Compliant: Yes; Mount: Surface Mount; Width: 0.098inch; Capacitance: 10uF; Tolerance: 10%
D30 = CMP-14398-000051-1: DIODE SCHOTTKY 30V 5A SOD128; RoHS Compliant: Yes
J135 = CMP-03356-000001-1: DDR4 SODIMM 260P 9.2H STD; Manufacturer: TE Connectivity; Voltage Rating: 25V; Current Rating: 0.5A; Is Female: yes; Pitch: 0.5mm; Memory Type: SDRAM,DDR; Conn Orientation: Horizontal; Number Of Contacts: 260; Temperature: -55°C to +85°C; Octopart: https://octopart.com/2309413-1-te+connectivity-84799194; Device Class L3: unset; Contact Material: Gold,Nickel; ComponentLink2URL: https://www.te.com/commerce/DocumentDelivery/DDEController?Action=showdoc&DocId=Specification+Or+Standard%7F108-115122%7FA1%7Fpdf%7FEnglish%7FENG_SS_108-115122_A1.pdf%7F2309413-1; Manufacturer Part Number: 2309413-1; ComponentLink2Description: Datasheet; Digikey Description: DDR4 SODIMM 260P 9.2H STD; Height: 18.8mm; Footprint Url: https://www.te.com/commerce/DocumentDelivery/DDEController?Action=showdoc&DocId=Customer+Drawing%7F2309413%7F4%7Fpdf%7FEnglish%7FENG_CD_2309413_4.pdf%7F2309413-1; Temperature Range Low: -55°C; Device Class L2: Memory Connectors; Temperature Range High: +85°C; RoHS: TRUE; Automotive: No; Device Class L1: Connectors; Mouser Description: Conn DDR4 DIMM Socket SKT 260 POS 0.5mm Solder RA SMD T/R; Category: Conn; Package: 0; Lead Free: Yes
MP3 MP4 = CMP-03913-59774857-1: 9774025243R Spacer Material: Steel, Tin-Plated Mounting: SMT Series: WA-SMST Thread D: M2; Outside Diameter: 4.3434mm; Threaded/Unthreaded: Threaded; Plating: Tin; REACH SVHC: Unknown; NexarPartId: 59774857; RoHS: Compliant; Material: Steel; Packaging: Tape and Reel; Max Operating Temperature: 150°C; Min Operating Temperature: -55°C; Length: 2.5mm; Height: 2.5mm
Q32 Q33 = CMP-013-00023-2: MOSFET Array, Dual N Channel, 20 V, 920 mA, 450 Milliohms, SOT-563, 6 Pins; Max Operating Temperature: 150°C; Min Operating Temperature: -55°C
R220-R244 = CMP-009-00002-14: Resistor
U26 = CMP-0244-00308-1: Fixed Low Drop Positive Voltage Regulator, 1.8V, 4-Pin SOT-223, Tape and Reel; ComponentLink1URL: http://www.st.com; PackageReference: SOT-223; PackageDescription: 4-Pin SOT-223 Package, 6.5 x 3.5 mm Body, 2.3 mm Pitch, 7 mm Lead Span; ComponentLink2URL: http://www.st.com/internet/com/TECHNICAL_RESOURCES/TECHNICAL_LITERATURE/DATASHEET/CD00000544.pdf; ComponentLink2Description: Datasheet; ComponentLink1Description: Manufacturer URL; DatasheetVersion: 1/11/2011; PackageVersion: 2010
U27 = CMP-2000-06816-1: TinyLogic UHS Buffer with Three-State Output, 1.65 to 5.5 V, -40 to 85 degC, 5-Pin SOT23, RoHS, Tape and Reel; Manufacturer: Fairchild Semiconductor; Input Signal Type: Single-Ended; Maximum Operating Supply Voltage: 5.5V; Number of Outputs per Chip: 1; Maximum Propagation Delay Time @ Maximum CL: 5.7@3.3V; Minimum Operating Supply Voltage: 1.65V; Maximum Quiescent Current: 2uA; Propagation Delay Test Condition: 50pF; Lead Finish: MatteTin; Number of Output Enables per Chip: 1Low; Maximum Low Level Output Current: 32mA; Output Type: 3-State; Package Version: 08/2015; Max Processing Temp: 260; Maximum High Level Output Current: -32mA; Tolerant I/Os: 5V; Bus Hold: No; Fabrication Technology: CMOS; Polarity: Non-Inverting; Typical Operating Supply Voltage: 1.8; Logic Function: Buffer/LineDriver; Manufacturer URL: https://www.fairchildsemi.com/; Mounting: SurfaceMount; Number of Channels per Chip: 1; Package Description: 5-Pin Small Outline Transistor, Body 2.9 x 1.6 mm, Pitch 0.95 mm; Package Reference: SOT23-5; Number of Elements per Chip: 1; Package URL: https://www.fairchildsemi.com/package-drawings/MA/MA05B.pdf; Datasheet URL: https://www.fairchildsemi.com/datasheets/NC/NC7SZ125.pdf; Datasheet Version: Rev. 1.0.5, 01/2014; Mounting Technology: SurfaceMount; Operating Temperature: -40to85C; Number of Inputs per Chip: 1

## Sheet M2_NVME.SchDoc
size C; SheetNumber: 2; SheetTotal: 19
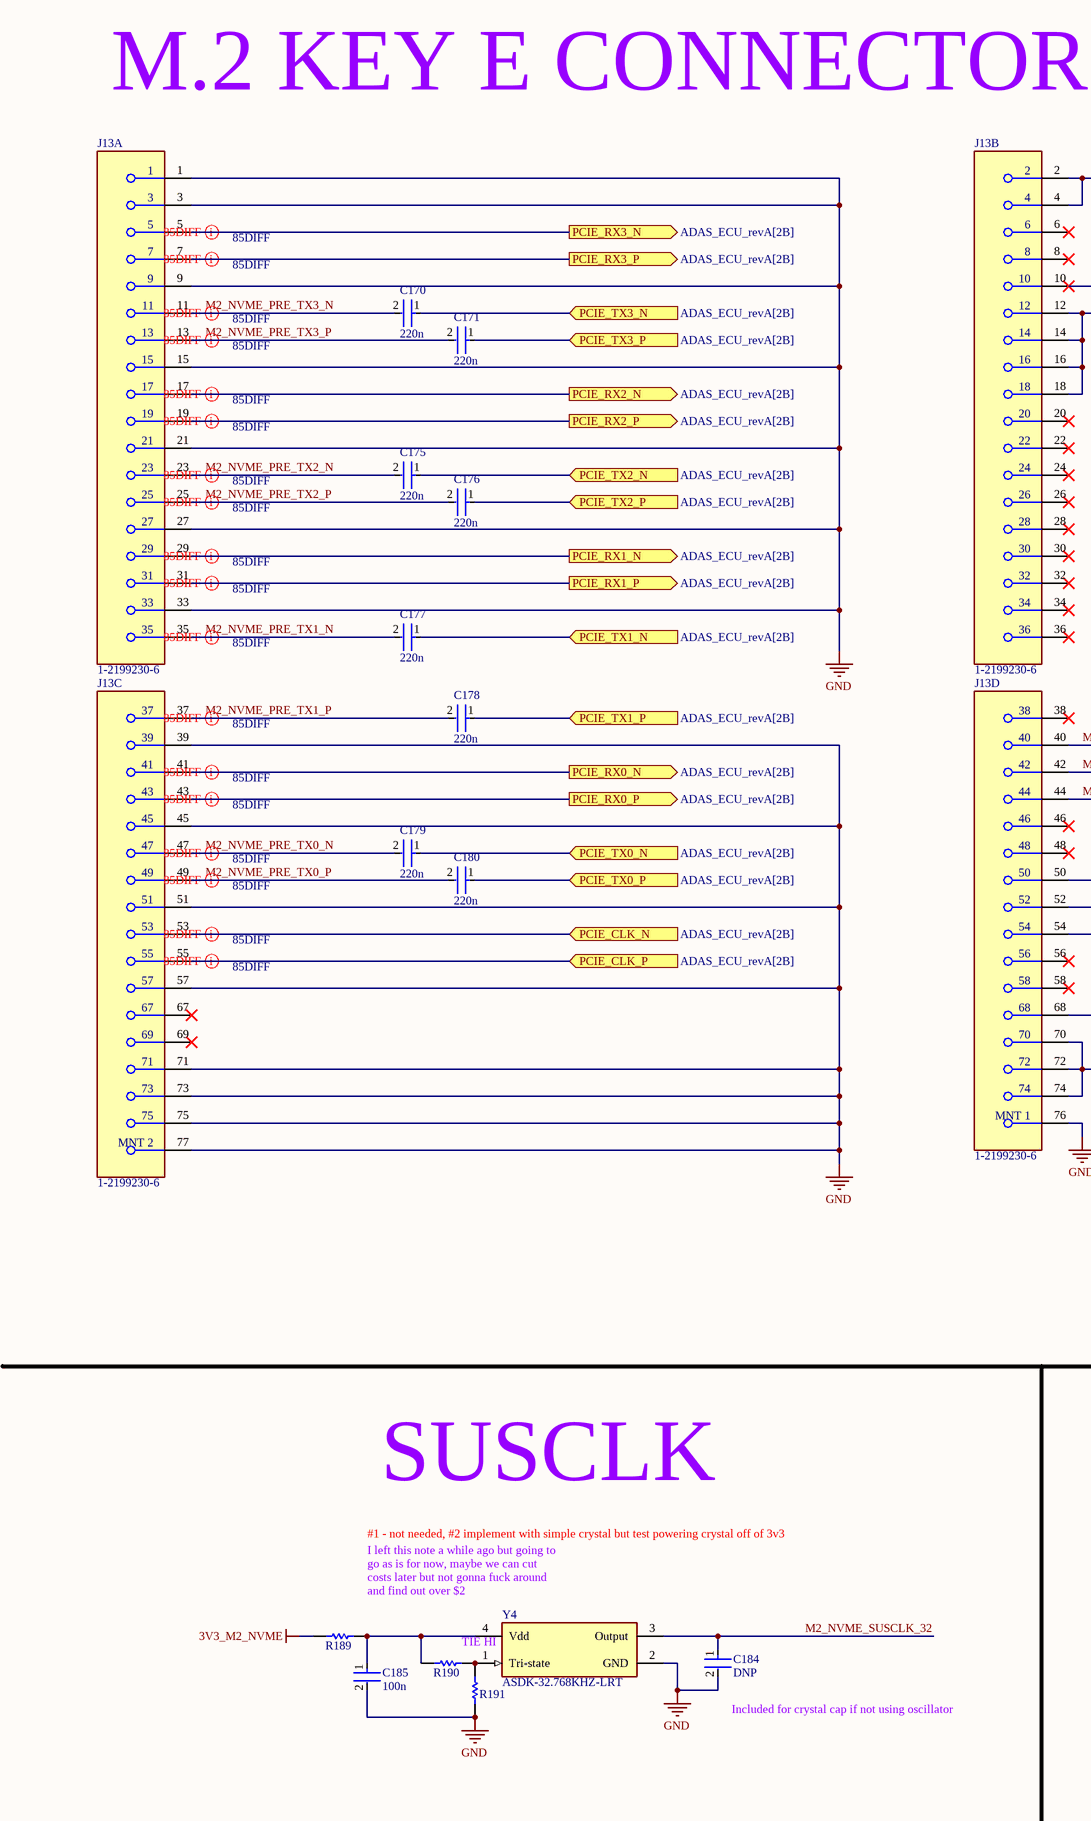
[diagram p16: M2_NVME.SchDoc, left]
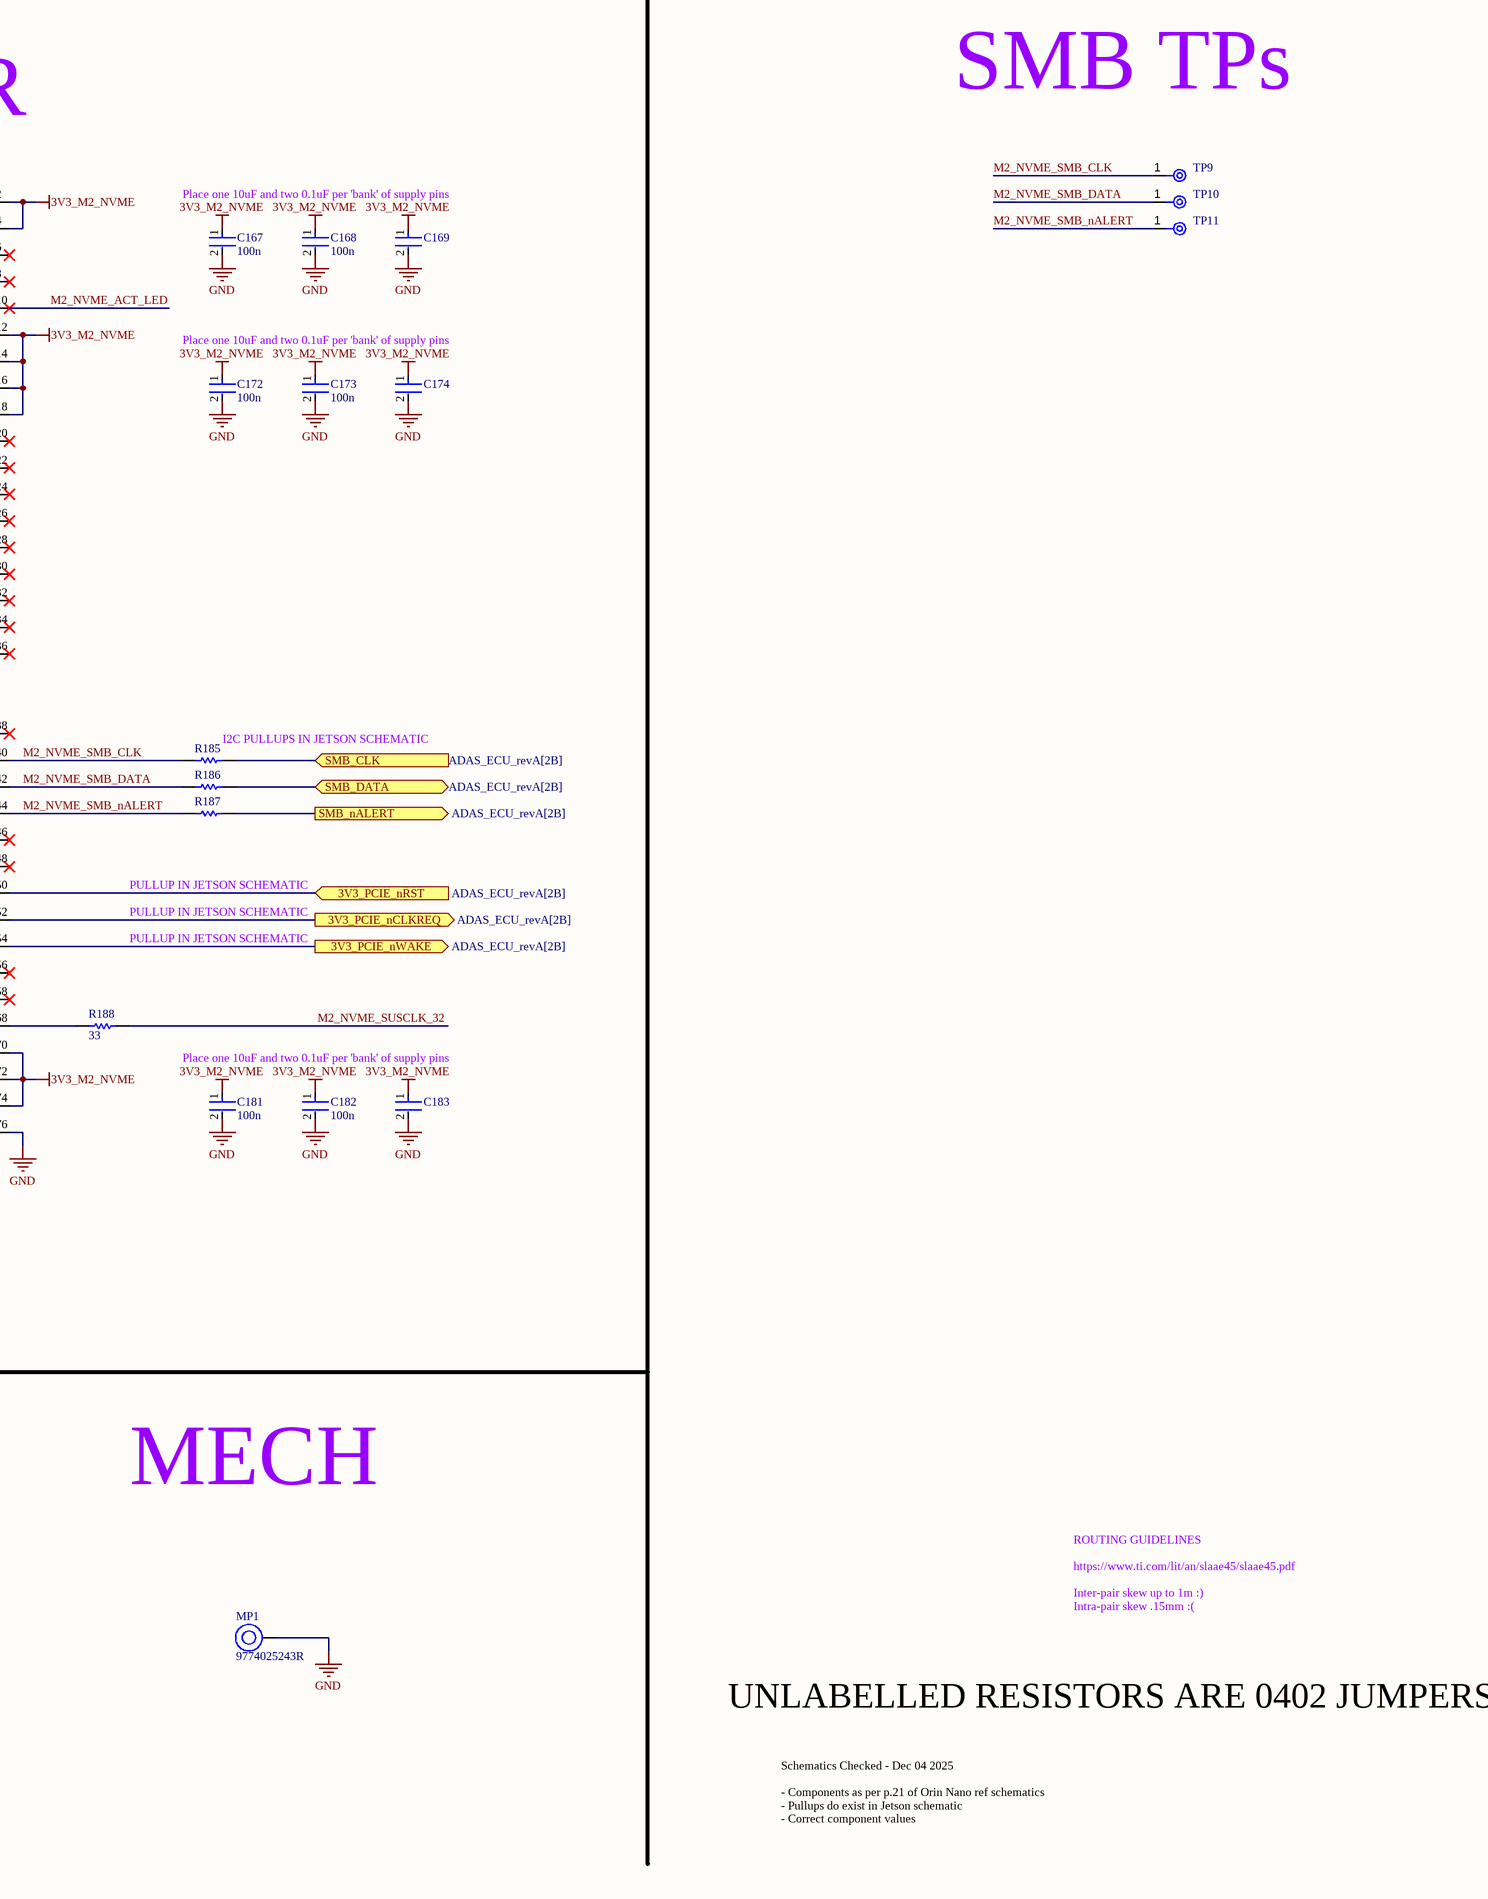
[diagram p17: M2_NVME.SchDoc, right]

### Parts
C167  100n  [FP-0402-L_1_0_0_05-W_0_5-IPC_A]
C168  100n  [FP-0402-L_1_0_0_05-W_0_5-IPC_A]
C169  GRM188R60J106ME47D  [FP-GRM188-0_1-e0_2_0_55-IPC_A]  (value not drawn)
C170  220n  [FP-0402-L_1_0_0_05-W_0_5-IPC_A]
C171  220n  [FP-0402-L_1_0_0_05-W_0_5-IPC_A]
C172  100n  [FP-0402-L_1_0_0_05-W_0_5-IPC_A]
C173  100n  [FP-0402-L_1_0_0_05-W_0_5-IPC_A]
C174  GRM188R60J106ME47D  [FP-GRM188-0_1-e0_2_0_55-IPC_A]  (value not drawn)
C175  220n  [FP-0402-L_1_0_0_05-W_0_5-IPC_A]
C176  220n  [FP-0402-L_1_0_0_05-W_0_5-IPC_A]
C177  220n  [FP-0402-L_1_0_0_05-W_0_5-IPC_A]
C178  220n  [FP-0402-L_1_0_0_05-W_0_5-IPC_A]
C179  220n  [FP-0402-L_1_0_0_05-W_0_5-IPC_A]
C180  220n  [FP-0402-L_1_0_0_05-W_0_5-IPC_A]
C181  100n  [FP-0402-L_1_0_0_05-W_0_5-IPC_A]
C182  100n  [FP-0402-L_1_0_0_05-W_0_5-IPC_A]
C183  GRM188R60J106ME47D  [FP-GRM188-0_1-e0_2_0_55-IPC_A]  (value not drawn)
C184  DNP  [FP-0402-L_1_0_0_05-W_0_5-IPC_A]
C185  100n  [FP-0402-L_1_0_0_05-W_0_5-IPC_A]
J13  1-2199230-6  [FP-1-2199230-6-MFG]  (parts A,B,C,D of 4)
MP1  9774025243R  [9774025243]
R185  DNP  [RESC1005X40X25ML05T05]  (value not drawn)
R186  DNP  [RESC1005X40X25ML05T05]  (value not drawn)
R187  DNP  [RESC1005X40X25ML05T05]  (value not drawn)
R188  33  [R0603B]
R189  0402 JUMPER  [RESC1005X40X25ML05T05]  (value not drawn)
R190  0402 JUMPER  [RESC1005X40X25ML05T05]  (value not drawn)
R191  DNP  [RESC1005X40X25ML05T05]  (value not drawn)
TP9  TPAD6R  [New footprint 1]  (value not drawn)
TP10  TPAD6R  [New footprint 1]  (value not drawn)
TP11  TPAD6R  [New footprint 1]  (value not drawn)
Y4  ASDK-32.768KHZ-LRT  [FP-ASDK-MFG]

### Ports
3V3_PCIE_nCLKREQ (out, see ADAS_ECU_revA[2B]), 3V3_PCIE_nRST (in, see ADAS_ECU_revA[2B]), 3V3_PCIE_nWAKE (out, see ADAS_ECU_revA[2B]), PCIE_CLK_N (in, see ADAS_ECU_revA[2B]), PCIE_CLK_P (in, see ADAS_ECU_revA[2B]), PCIE_RX0_N (out, see ADAS_ECU_revA[2B]), PCIE_RX0_P (out, see ADAS_ECU_revA[2B]), PCIE_RX1_N (out, see ADAS_ECU_revA[2B]), PCIE_RX1_P (out, see ADAS_ECU_revA[2B]), PCIE_RX2_N (out, see ADAS_ECU_revA[2B]), PCIE_RX2_P (out, see ADAS_ECU_revA[2B]), PCIE_RX3_N (out, see ADAS_ECU_revA[2B]), PCIE_RX3_P (out, see ADAS_ECU_revA[2B]), PCIE_TX0_N (in, see ADAS_ECU_revA[2B]), PCIE_TX0_P (in, see ADAS_ECU_revA[2B]), PCIE_TX1_N (in, see ADAS_ECU_revA[2B]), PCIE_TX1_P (in, see ADAS_ECU_revA[2B]), PCIE_TX2_N (in, see ADAS_ECU_revA[2B]), PCIE_TX2_P (in, see ADAS_ECU_revA[2B]), PCIE_TX3_N (in, see ADAS_ECU_revA[2B]), PCIE_TX3_P (in, see ADAS_ECU_revA[2B]), SMB_CLK (in, see ADAS_ECU_revA[2B]), SMB_DATA (bidir, see ADAS_ECU_revA[2B]), SMB_nALERT (out, see ADAS_ECU_revA[2B])

### Nets
3V3_M2_NVME: C167.1 C168.1 C169.1 C172.1 C173.1 C174.1 C181.1 C182.1 C183.1 J13.2 J13.4 J13.12 J13.14 J13.16 J13.18 J13.70 J13.72 J13.74 R189.1
GND: C167.2 C168.2 C169.2 C172.2 C173.2 C174.2 C181.2 C182.2 C183.2 C184.2 C185.2 J13.1 J13.3 J13.9 J13.15 J13.21 J13.27 J13.33 J13.39 J13.45 J13.51 J13.57 J13.71 J13.73 J13.75 J13.76(MNT_1) J13.77(MNT_2) MP1.1 R191.1 Y4.2(GND)
1V8_I2C2_SCL: R185.2 ; port SMB_CLK
1V8_I2C2_SDA: R186.2 ; port SMB_DATA
3V3_PCIE0_CLKREQ: J13.52 ; port 3V3_PCIE_nCLKREQ
3V3_PCIE0_nRST: J13.50 ; port 3V3_PCIE_nRST
3V3_PCIE0_nWAKE: J13.54 ; port 3V3_PCIE_nWAKE
M2_NVME_ACT_LED: J13.10
M2_NVME_PRE_TX0_N: C179.2 J13.47
M2_NVME_PRE_TX0_P: C180.2 J13.49
M2_NVME_PRE_TX1_N: C177.2 J13.35
M2_NVME_PRE_TX1_P: C178.2 J13.37
M2_NVME_PRE_TX2_N: C175.2 J13.23
M2_NVME_PRE_TX2_P: C176.2 J13.25
M2_NVME_PRE_TX3_N: C170.2 J13.11
M2_NVME_PRE_TX3_P: C171.2 J13.13
M2_NVME_SMB_CLK: J13.40 R185.1 TP9.1(TP)
M2_NVME_SMB_DATA: J13.42 R186.1 TP10.1(TP)
M2_NVME_SMB_nALERT: J13.44 R187.1 TP11.1(TP)
M2_NVME_SUSCLK_32: C184.1 R188.1 Y4.3(Output)
nNVME_M2_ALERT: R187.2 ; port SMB_nALERT
PCIE0_CLK_N: J13.53 ; port PCIE_CLK_N
PCIE0_CLK_P: J13.55 ; port PCIE_CLK_P
PCIE0_RX0_N: J13.5 ; port PCIE_RX3_N
PCIE0_RX0_P: J13.7 ; port PCIE_RX3_P
PCIE0_RX1_N: J13.17 ; port PCIE_RX2_N
PCIE0_RX1_P: J13.19 ; port PCIE_RX2_P
PCIE0_RX2_N: J13.29 ; port PCIE_RX1_N
PCIE0_RX2_P: J13.31 ; port PCIE_RX1_P
PCIE0_RX3_N: J13.41 ; port PCIE_RX0_N
PCIE0_RX3_P: J13.43 ; port PCIE_RX0_P
PCIE0_TX0_N: C170.1 ; port PCIE_TX3_N
PCIE0_TX0_P: C171.1 ; port PCIE_TX3_P
PCIE0_TX1_N: C175.1 ; port PCIE_TX2_N
PCIE0_TX1_P: C176.1 ; port PCIE_TX2_P
PCIE0_TX2_N: C177.1 ; port PCIE_TX1_N
PCIE0_TX2_P: C178.1 ; port PCIE_TX1_P
PCIE0_TX3_N: C179.1 ; port PCIE_TX0_N
PCIE0_TX3_P: C180.1 ; port PCIE_TX0_P
NetC185_1: C185.1 R189.2 R190.1 Y4.4(Vdd)
NetJ13_68: J13.68 R188.2
NetR190_2: R190.2 R191.2 Y4.1(Tri-state)

Not connected (* = marked no-connect by the designer): J13 6* 8* 20* 22* 24* 26* 28* 30* 32* 34* 36* 38* 46* 48* 56* 58* 67* 69*

### Layout directives
differential pair; differential pair class 85DIFF: M2_NVME_PRE_TX0_N, M2_NVME_PRE_TX0_P, M2_NVME_PRE_TX1_N, M2_NVME_PRE_TX1_P, M2_NVME_PRE_TX2_N, M2_NVME_PRE_TX2_P, M2_NVME_PRE_TX3_N, M2_NVME_PRE_TX3_P, PCIE0_CLK_N, PCIE0_CLK_P, PCIE0_RX0_N, PCIE0_RX0_P, PCIE0_RX1_N, PCIE0_RX1_P, PCIE0_RX2_N, PCIE0_RX2_P, PCIE0_RX3_N, PCIE0_RX3_P

### Notes on the sheet
- M.2 KEY E CONNECTOR
- SMB TPs
- Place one 10uF and two 0.1uF per 'bank' of supply pins
- (near R185) I2C PULLUPS IN JETSON SCHEMATIC
- PULLUP IN JETSON SCHEMATIC
- SUSCLK
- MECH
- #1 - not needed, #2 implement with simple crystal but test powering crystal off of 3v3
- I left this note a while ago but going to go as is for now, maybe we can cut costs later but not gonna fuck around and find out over $2
- (near Y4) TIE HI
- ROUTING GUIDELINES
  https://www.ti.com/lit/an/slaae45/slaae45.pdf
  Inter-pair skew up to 1m :)
  Intra-pair skew .15mm :(
- (near C184) Included for crystal cap if not using oscillator
- UNLABELLED RESISTORS ARE 0402 JUMPERS
- Schematics Checked - Dec 04 2025
  - Components as per p.21 of Orin Nano ref schematics
  - Pullups do exist in Jetson schematic
  - Correct component values

### Library data of the parts
C167 C168 C170-C173 C175-C182 C184 C185 = CMP-001-00058-1: as C231-C233 on sheet JETSON_V2; Min Operating Temperature: -55°C; Mounting Technology: Surface Mount; Pins: 2; Case/Package: 0402; RoHS Compliant: Yes; Max Operating Temperature: 85°C
C169 C174 C183 = CMP-2006-02792-2: as C234 on sheet JETSON_V2; Packaging: Tape and Reel; Voltage Rating (DC): 6.3V; Width: 0.031inch; Termination: SMD/SMT; Dielectric: X5R; Package Quantity: 4000; Voltage Rating: 6.3V; Capacitance: 10uF; Case/Package: 0603; Min Operating Temperature: -55°C; Voltage: 6.3V; Length: 1.6mm; Thickness: 0.035inch; Lead Free: Lead Free; Depth: 0.8mm; Case Code (Imperial): 0603; Max Operating Temperature: 85°C; Material: Ceramic; Height: 0.8mm; Tolerance: 20%; Mount: Surface Mount; REACH SVHC: No SVHC; Radiation Hardening: No; Case Code (Metric): 1608
J13 = CMP-03365-000001-1: CONN EDGE DUAL FMALE 67POS 0.020; Manufacturer: TE; Number Of Contacts: 67; Current Rating: 0.5A; Pitch: 0.5mm; Conn Gender: Female; Is Female: yes; Voltage Rating: 50V; Conn Orientation: Right Angle; Automotive: No; Temperature Range High: +80°C; Package: 1-2199230-6; Category: Conn; Temperature: -40°C to +80°C; Number Of Rows: 2; ComponentLink2URL: http://www.te.com/commerce/DocumentDelivery/DDEController?Action=showdoc&DocId=Specification+Or+Standard%7F114-115006%7FB%7Fpdf%7FEnglish%7FENG_SS_114-115006_B_114-115006_REV_B.pdf%7F1-2199230-6; Manufacturer Part Number: 1-2199230-6; Height: 4.2mm; RoHS: TRUE; Footprint Url: http://www.te.com/commerce/DocumentDelivery/DDEController?Action=showdoc&DocId=Customer+Drawing%7F2199230%7FB2%7Fpdf%7FEnglish%7FENG_CD_2199230_B2.pdf%7F1-2199230-6; Digikey Description: CONN EDGE DUAL FMALE 67POS 0.020; Device Class L2: Card Edge Connectors; Contact Material: Gold,Tin; Device Class L1: Connectors; Device Class L3: unset; ComponentLink2Description: Datasheet; Temperature Range Low: -40°C; Octopart: https://octopart.com/1-2199230-6-te+connectivity-34969376; Lead Free: Yes
MP1 = CMP-03913-59774857-1: as MP3 on sheet JETSON_V2; REACH SVHC: Unknown; NexarPartId: 59774857; RoHS: Compliant; Material: Steel; Packaging: Tape and Reel; Max Operating Temperature: 150°C; Min Operating Temperature: -55°C; Length: 2.5mm; Height: 2.5mm
R185-R187 R189-R191 = CMP-009-00118-2: READ THE NAME; Pins: 2; Component Type: Standard; Design Item ID: CMP-009-00206-2; Source: 0402jump.SchLib
R188 = CMP-009-00002-14: Resistor
TP9-TP11 = CMP-00025-2: Test Point .6mm
Y4 = CMP-27762-001115-1: XTAL OSC XO 32.7680KHZ CMOS SMD; Load Capacitance: 15pF; Max Supply Current: 3.5mA; Min Supply Voltage: 2.97V; Operating Supply Voltage: 3.3V; Frequency Stability: 25ppm; Lead Free: Lead Free; Case/Package: CSMD; Number of Pins: 4; Max Operating Temperature: 85°C; Packaging: Tape and Reel; Width: 0.079inch; Min Operating Temperature: -40°C; Radiation Hardening: No; Length: 2.5mm; Depth: 2mm; Termination: SMD/SMT; Height: 0.037inch; Series: ASDK; Frequency: 32.768kHz; Mount: Surface Mount

## Sheet RAIL_DISCHARGE.SchDoc
size A4; SheetNumber: 4; SheetTotal: 25
Used 3 times, as channels RAIL_DISCH_0, RAIL_DISCH_1, RAIL_DISCH_2. Parts and nets are listed once, with the designators drawn on the sheet.
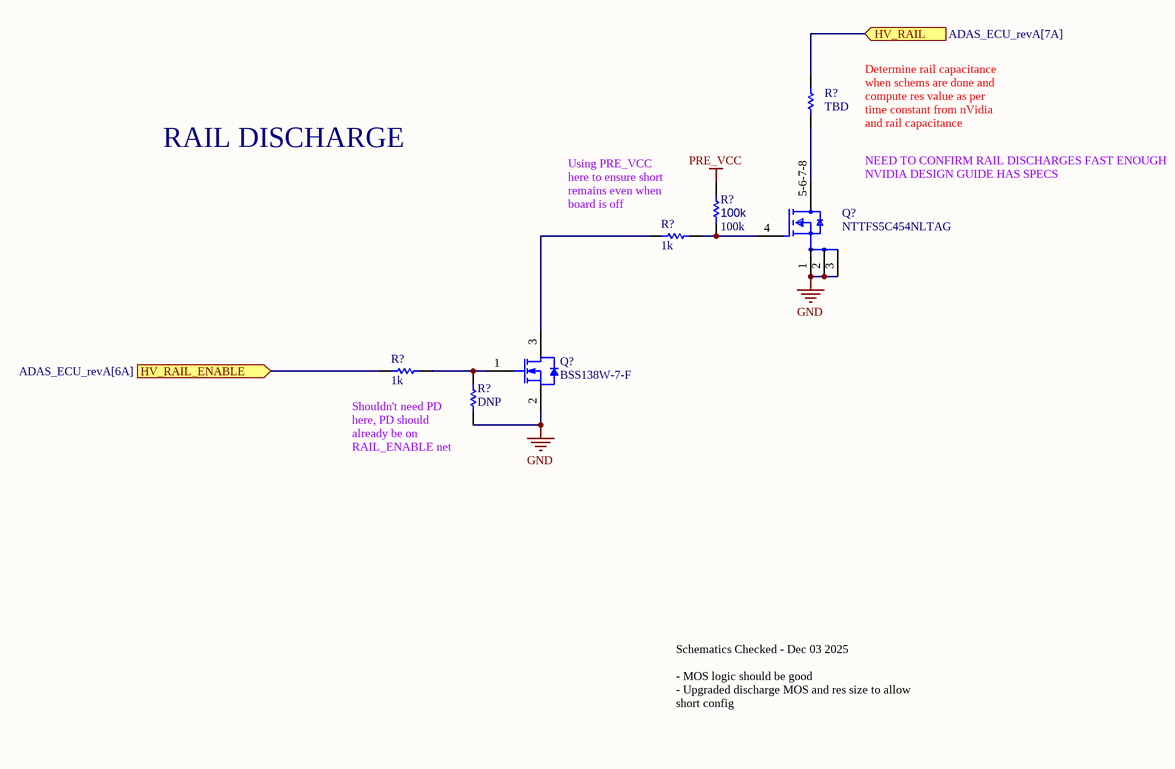
[diagram p18: RAIL_DISCHARGE.SchDoc]

### Parts
(Parts that share a designator on the sheet are numbered #1, #2 ... from top to bottom, then left to right.)
Q?#1  NTTFS5C454NLTAG  [FP-511AB-MFG]
Q?#2  BSS138W-7-F  [DIOD-SOT323-3_V]
R?#1  TBD  [R1206B]
R?#2  100k  [R0603B]
R?#3  1k  [R0603B]
R?#4  1k  [R0603B]
R?#5  DNP  [R0603B]

### Ports
HV_RAIL (in, see ADAS_ECU_revA[7A]), HV_RAIL_ENABLE (in, see ADAS_ECU_revA[6A])

### Nets
GND: Q?#1.1(S) Q?#1.2(S) Q?#1.3(S) Q?#2.2(S) R?#5.2
PRE_VCC: R?#2.2
HV_RAIL: R?#1.1 ; port HV_RAIL
HV_RAIL_ENABLE: R?#4.2 ; port HV_RAIL_ENABLE
NetQ?#1_4: Q?#1.4(G) R?#2.1 R?#3.2
NetQ?#1_5-6-7-8: Q?#1.5-6-7-8(D) R?#1.2
NetQ?#2_1: Q?#2.1(G) R?#4.1 R?#5.1
NetQ?#2_3: Q?#2.3(D) R?#3.1

### Channels
RAIL_DISCH_0: designators Q?=Q?_RAIL_DISCH_0#2 Q?=Q?_RAIL_DISCH_0#1 R?=R?_RAIL_DISCH_0#3 R?=R?_RAIL_DISCH_0#5 R?=R?_RAIL_DISCH_0#4 R?=R?_RAIL_DISCH_0#1 R?=R?_RAIL_DISCH_0#2; ports HV_RAIL=12V0_MAIN HV_RAIL_ENABLE=3V3_12V0_MAIN_ENABLE
RAIL_DISCH_1: designators Q?=Q?_RAIL_DISCH_1#2 Q?=Q?_RAIL_DISCH_1#1 R?=R?_RAIL_DISCH_1#3 R?=R?_RAIL_DISCH_1#5 R?=R?_RAIL_DISCH_1#4 R?=R?_RAIL_DISCH_1#1 R?=R?_RAIL_DISCH_1#2; ports HV_RAIL=5V0_MAIN HV_RAIL_ENABLE=3V3_5V0_MAIN_ENABLE
RAIL_DISCH_2: designators Q?=Q?_RAIL_DISCH_2#2 Q?=Q?_RAIL_DISCH_2#1 R?=R?_RAIL_DISCH_2#3 R?=R?_RAIL_DISCH_2#5 R?=R?_RAIL_DISCH_2#4 R?=R?_RAIL_DISCH_2#1 R?=R?_RAIL_DISCH_2#2; ports HV_RAIL=3V3_MAIN HV_RAIL_ENABLE=3V3_3V3_MAIN_ENABLE

### Notes on the sheet
- Determine rail capacitance when schems are done and compute res value as per time constant from nVidia and rail capacitance
- RAIL DISCHARGE
- NEED TO CONFIRM RAIL DISCHARGES FAST ENOUGH
- (near Q?#1) NVIDIA DESIGN GUIDE HAS SPECS
- (near R?#3) Using PRE_VCC here to ensure short remains even when board is off
- (near R?#5) Shouldn't need PD here, PD should already be on RAIL_ENABLE net
- Schematics Checked - Dec 03 2025
  - MOS logic should be good
  - Upgraded discharge MOS and res size to allow short config

### Library data of the parts
Q?#1 = CMP-00278-71475164-1: NTTFS5C454NLTAG Single N-Channel Power MOSFET 40V, 85A, 3.8mΩ Power MOSFET 40V, 85A, 3.8 mOhm, Single N-Channel, u8FL, Logic Level; Manufacturer Lifecycle Status: ACTIVE; Max Power Dissipation: 3.2W; Turn-On Delay Time: 9.3ns; Turn-Off Delay Time: 17ns; Gate to Source Voltage (Vgs): 20V; Continuous Drain Current (ID): 20A; Drain to Source Resistance: 4.8mΩ; Max Junction Temperature (Tj): 175°C; Input Capacitance: 1.6nF; Number of Channels: 1; Threshold Voltage: 2V; Lead Free: Lead Free; Drain to Source Voltage (Vdss): 40V; Schedule B: 8541290080; Number of Pins: 8; Mount: Surface Mount; Power Dissipation: 3.2W; Min Operating Temperature: -55°C; RoHS: Compliant; Drain to Source Breakdown Voltage: 40V; Max Operating Temperature: 175°C; Height: 800µm; Lifecycle Status: Production; NexarPartId: 71475164; REACH SVHC: No SVHC; Rds On Max: 3.8mΩ
Q?#2 = CMP-2000-05968-1: N-Channel Enhancement Mode Mosfet, 50 V, 200 mA, -55 to 150 degC, 6-Pin SOT-323, RoHS, Tape and Reel; Typical Turn-Off Delay Time: 20ns; Number of Channels: 1Channel; Type: EnhancementModeFieldEffectTransistor; Brand: DiodesIncorporated; Vds - Drain-Source Breakdown Voltage: 75V; Vgs - Gate-Source Voltage: 20V; Rds On - Drain-Source Resistance: 1.4Ohms; Transistor Type: 1N-Channel; Configuration: Single; Unit Weight: 0.000212oz; Pd - Power Dissipation: 200mW; Id - Continuous Drain Current: 200mA; Forward Transconductance - Min: 0.1S; Manufacturer URL: http://www.diodes.com/; Series: BSS138; Package Description: 3-Pin Small Outline Transistor, Body 2 x 1.25 mm, Pitch 0.65 mm; Mounting Technology: SurfaceMount; Product Category: MOSFET; RoHS: True; Maximum Operating Temperature: +150C; Height: 1mm; Length: 2.2mm; Technology: Si; Width: 1.35mm; Datasheet URL: http://www.diodes.com/_files/datasheets/ds30206.pdf; Manufacturer: DiodesIncorporated; Package / Case: SOT-323-3; Typical Turn-On Delay Time: 20ns; Transistor Polarity: N-Channel; Factory Pack Quantity: 3000; Packaging: Reel; Product: MOSFETSmallSignal; Datasheet Version: Rev. 11-2, 09/2013; Package Reference: SOT323; Minimum Operating Temperature: -55C; Mounting Style: SMD/SMT; Channel Mode: Enhancement
R?#1-R?#5 = CMP-009-00002-14: Resistor
  R?#1: Value: TBD
  R?#2: Value: 100k
  R?#3 R?#4: Value: 1k
  R?#5: Value: DNP

## Sheet M2_WIFI.SchDoc
size C; SheetNumber: 5; SheetTotal: 19
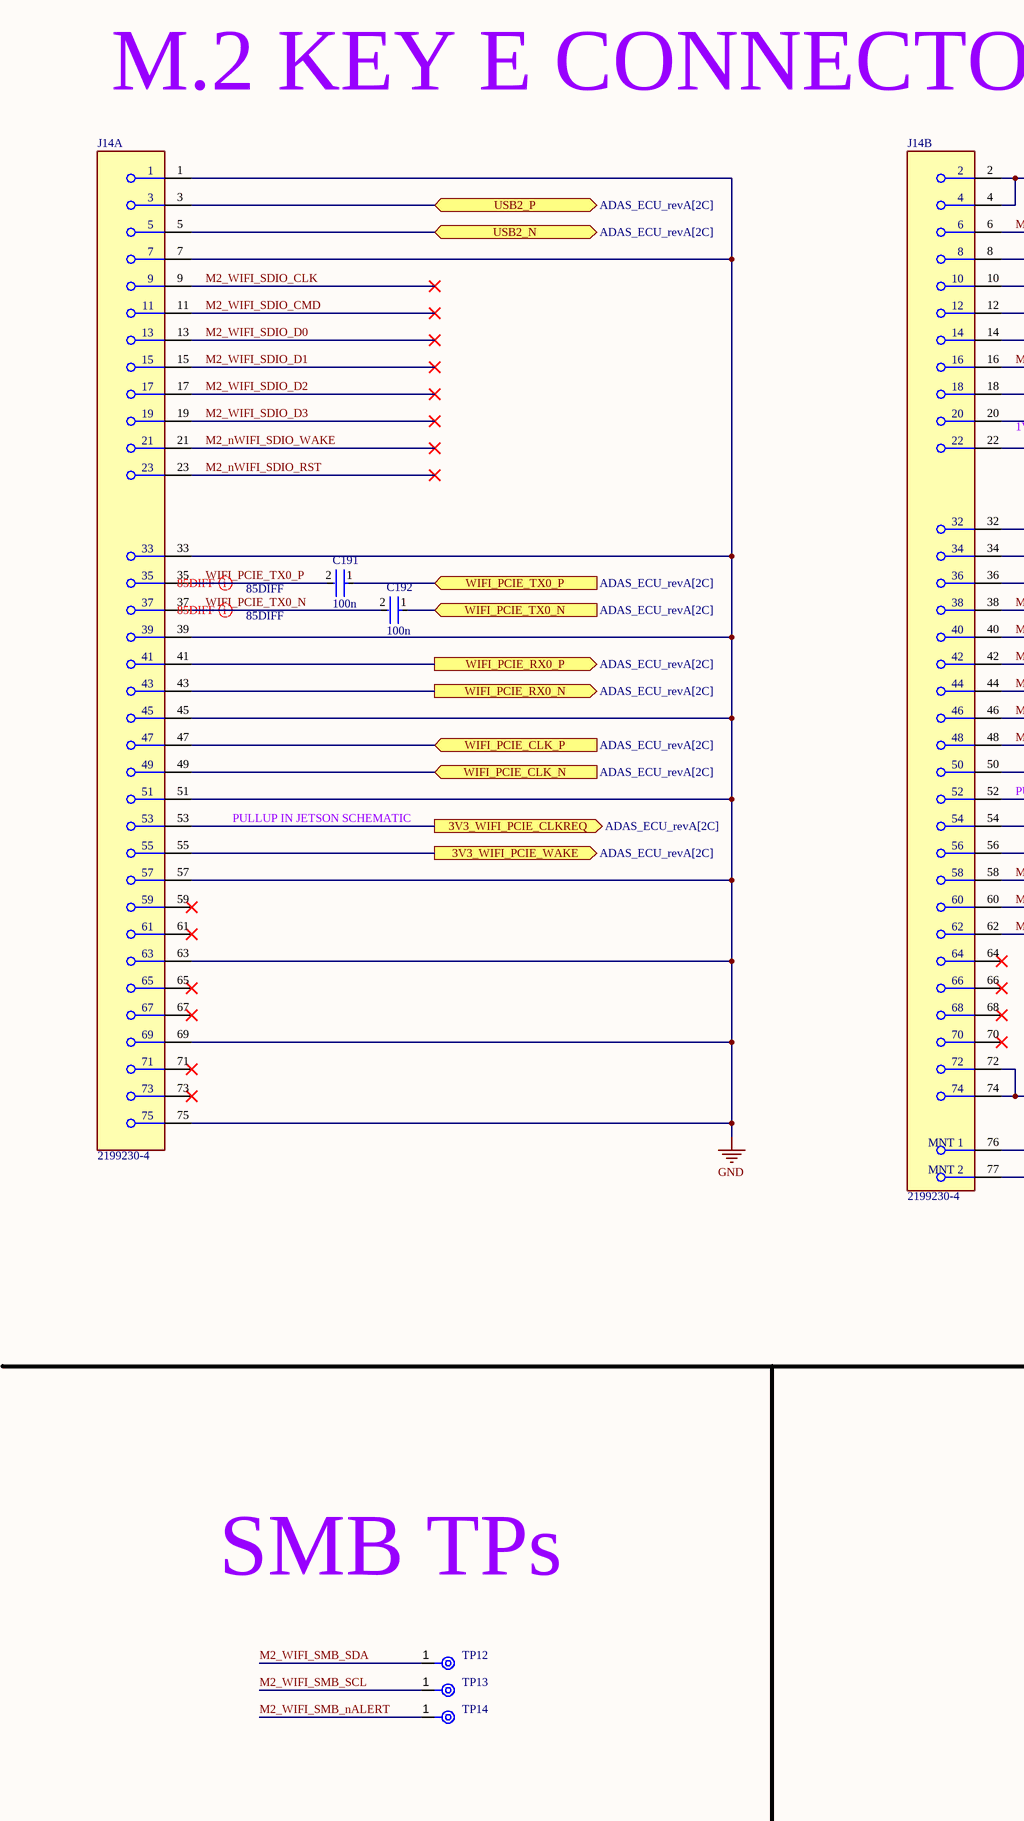
[diagram p19: M2_WIFI.SchDoc, left]
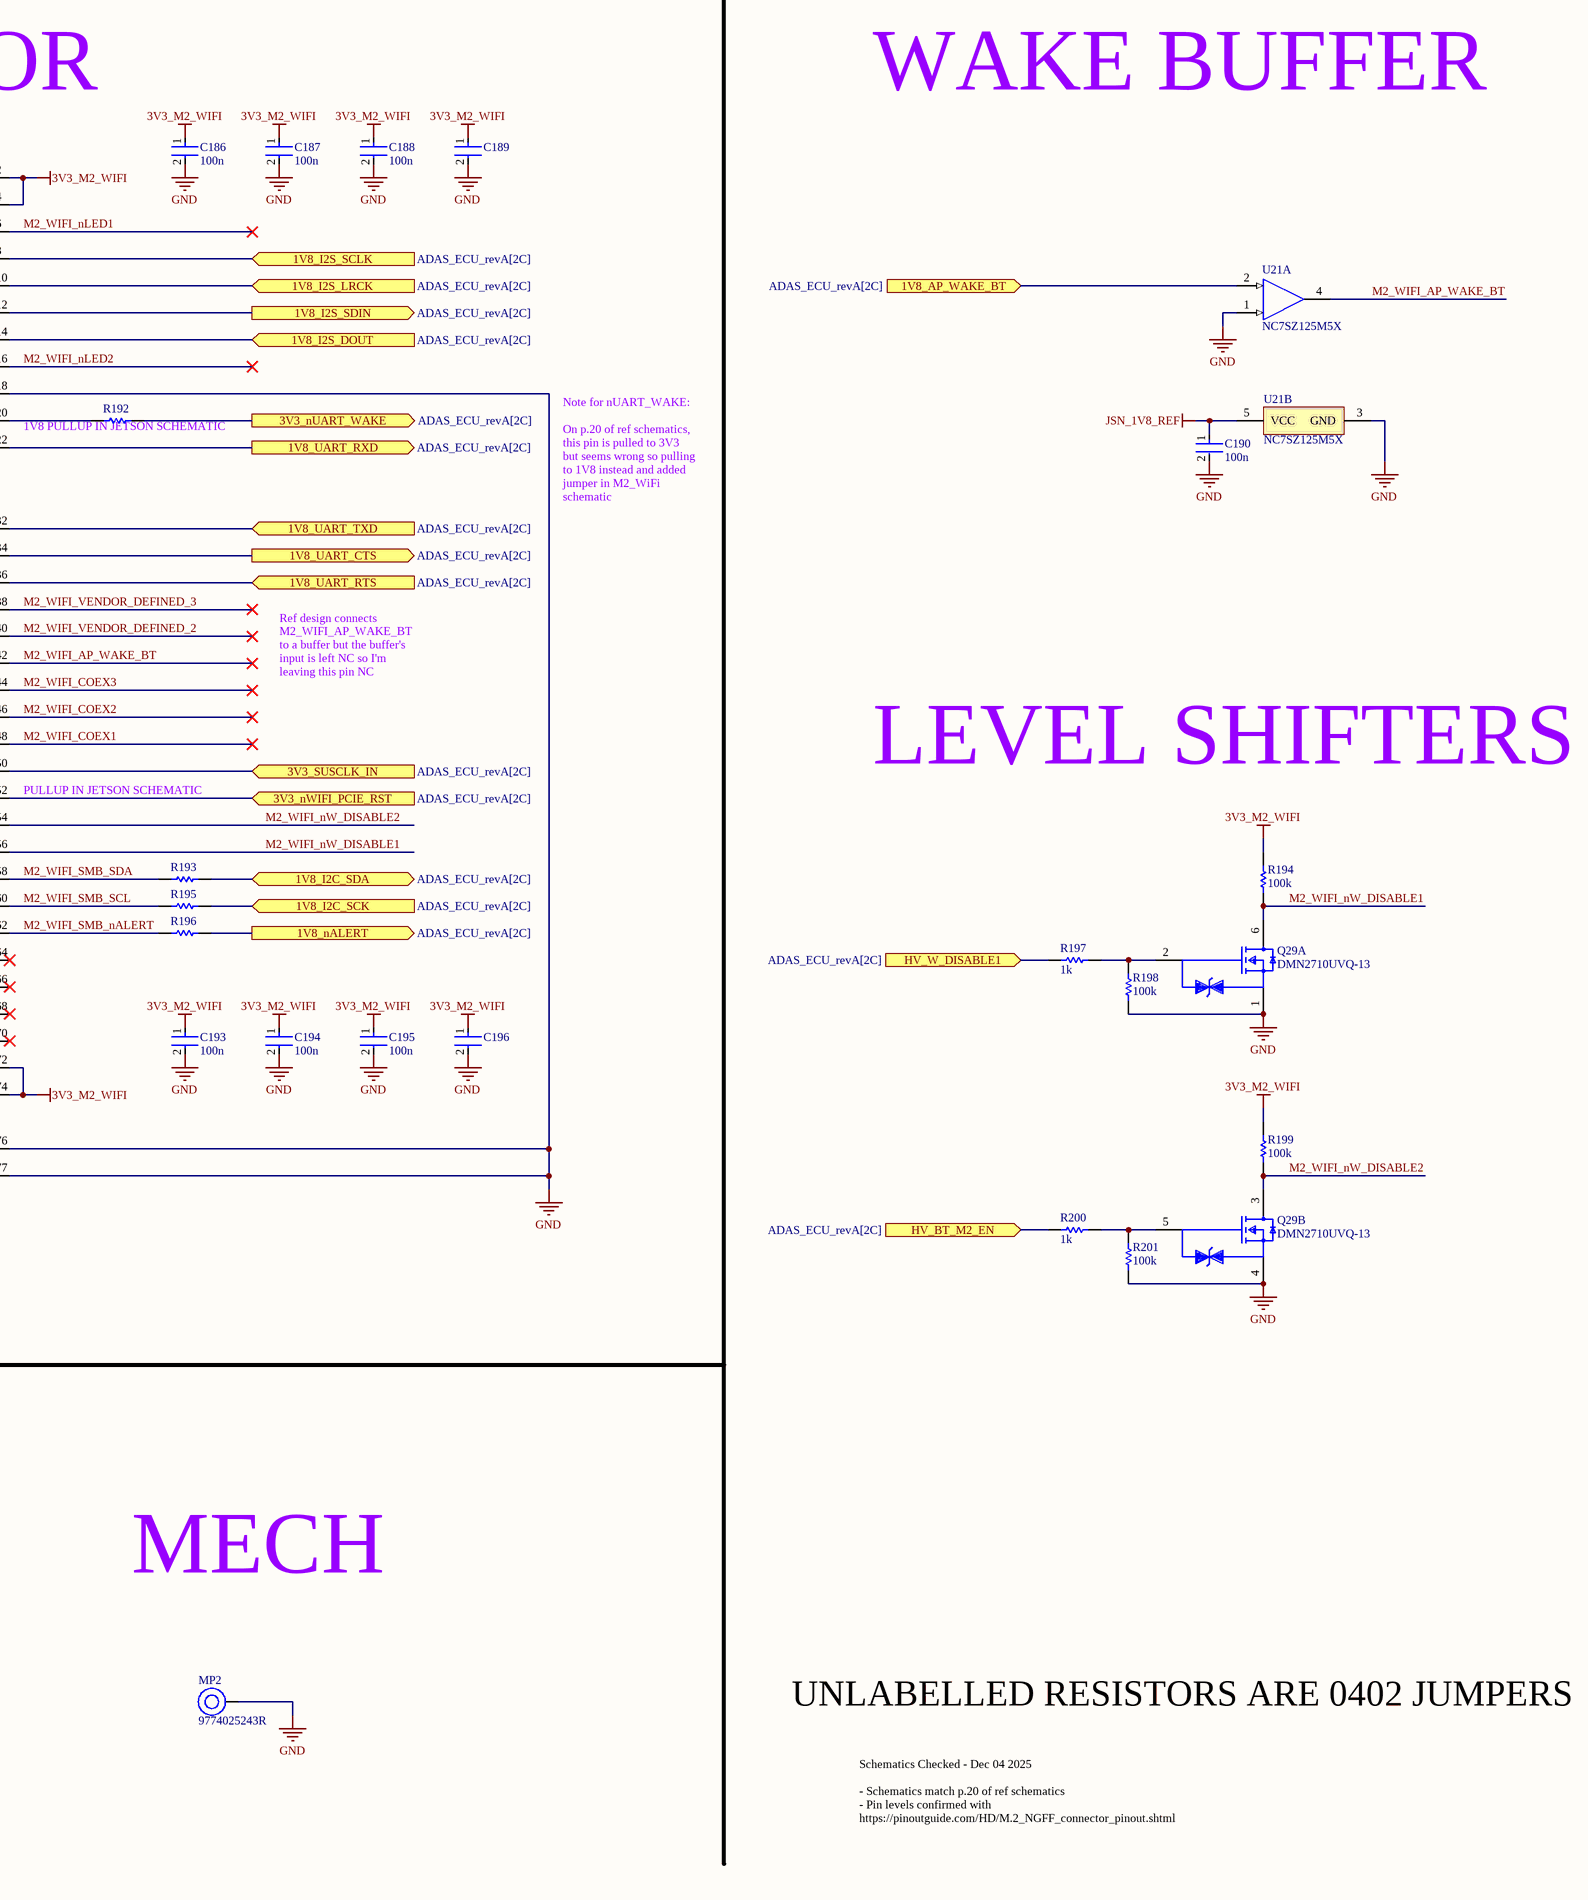
[diagram p20: M2_WIFI.SchDoc, right]

### Parts
C186  100n  [FP-0402-L_1_0_0_05-W_0_5-IPC_A]
C187  100n  [FP-0402-L_1_0_0_05-W_0_5-IPC_A]
C188  100n  [FP-0402-L_1_0_0_05-W_0_5-IPC_A]
C189  GRM188R60J106ME47D  [FP-GRM188-0_1-e0_2_0_55-IPC_A]  (value not drawn)
C190  100n  [FP-0402-L_1_0_0_05-W_0_5-IPC_A]
C191  100n  [FP-0402-L_1_0_0_05-W_0_5-IPC_A]
C192  100n  [FP-0402-L_1_0_0_05-W_0_5-IPC_A]
C193  100n  [FP-0402-L_1_0_0_05-W_0_5-IPC_A]
C194  100n  [FP-0402-L_1_0_0_05-W_0_5-IPC_A]
C195  100n  [FP-0402-L_1_0_0_05-W_0_5-IPC_A]
C196  GRM188R60J106ME47D  [FP-GRM188-0_1-e0_2_0_55-IPC_A]  (value not drawn)
J14  2199230-4  [FP-2199230-4-MFG]  (parts A,B of 2)
MP2  9774025243R  [9774025243]
Q29  DMN2710UVQ-13  [SOTFL50P162X60-6N]  (parts A,B of 2)
R192  0402 JUMPER  [RESC1005X40X25ML05T05]  (value not drawn)
R193  DNP  [RESC1005X40X25ML05T05]  (value not drawn)
R194  100k  [R0603B]
R195  DNP  [RESC1005X40X25ML05T05]  (value not drawn)
R196  DNP  [RESC1005X40X25ML05T05]  (value not drawn)
R197  1k  [R0603B]
R198  100k  [R0603B]
R199  100k  [R0603B]
R200  1k  [R0603B]
R201  100k  [R0603B]
TP12  TPAD6R  [New footprint 1]  (value not drawn)
TP13  TPAD6R  [New footprint 1]  (value not drawn)
TP14  TPAD6R  [New footprint 1]  (value not drawn)
U21  NC7SZ125M5X  [FAIR-SOT23-5_V]  (parts A,B of 2)

### Ports
1V8_AP_WAKE_BT (in, see ADAS_ECU_revA[2C]), 1V8_I2C_SCK (in, see ADAS_ECU_revA[2C]), 1V8_I2C_SDA (bidir, see ADAS_ECU_revA[2C]), 1V8_I2S_DOUT (in, see ADAS_ECU_revA[2C]), 1V8_I2S_LRCK (in, see ADAS_ECU_revA[2C]), 1V8_I2S_SCLK (in, see ADAS_ECU_revA[2C]), 1V8_I2S_SDIN (out, see ADAS_ECU_revA[2C]), 1V8_nALERT (out, see ADAS_ECU_revA[2C]), 1V8_UART_CTS (out, see ADAS_ECU_revA[2C]), 1V8_UART_RTS (in, see ADAS_ECU_revA[2C]), 1V8_UART_RXD (out, see ADAS_ECU_revA[2C]), 1V8_UART_TXD (in, see ADAS_ECU_revA[2C]), 3V3_nUART_WAKE (out, see ADAS_ECU_revA[2C]), 3V3_nWIFI_PCIE_RST (in, see ADAS_ECU_revA[2C]), 3V3_SUSCLK_IN (in, see ADAS_ECU_revA[2C]), 3V3_WIFI_PCIE_CLKREQ (out, see ADAS_ECU_revA[2C]), 3V3_WIFI_PCIE_WAKE (out, see ADAS_ECU_revA[2C]), HV_BT_M2_EN (in, see ADAS_ECU_revA[2C]), HV_W_DISABLE1 (in, see ADAS_ECU_revA[2C]), USB2_N (bidir, see ADAS_ECU_revA[2C]), USB2_P (bidir, see ADAS_ECU_revA[2C]), WIFI_PCIE_CLK_N (in, see ADAS_ECU_revA[2C]), WIFI_PCIE_CLK_P (in, see ADAS_ECU_revA[2C]), WIFI_PCIE_RX0_N (out, see ADAS_ECU_revA[2C]), WIFI_PCIE_RX0_P (out, see ADAS_ECU_revA[2C]), WIFI_PCIE_TX0_N (in, see ADAS_ECU_revA[2C]), WIFI_PCIE_TX0_P (in, see ADAS_ECU_revA[2C])

### Nets
3V3_M2_WIFI: C186.1 C187.1 C188.1 C189.1 C193.1 C194.1 C195.1 C196.1 J14.2 J14.4 J14.72 J14.74 R194.2 R199.2
GND: C186.2 C187.2 C188.2 C189.2 C190.2 C193.2 C194.2 C195.2 C196.2 J14.1 J14.7 J14.18 J14.33 J14.39 J14.45 J14.51 J14.57 J14.63 J14.69 J14.75 J14.76(MNT_1) J14.77(MNT_2) MP2.1 Q29.1(Source1) Q29.4(Source2) R198.1 R201.1 U21.1(~{OE}) U21.3(GND)
JSN_1V8_REF: C190.1 U21.5(VCC)
1V8_BT_M2_EN (GPIO03): R200.2 ; port HV_BT_M2_EN
1V8_BT_M2_WAKE_AP (GPIO02): R192.2 ; port 3V3_nUART_WAKE
1V8_I2C2_SCL: R195.2 ; port 1V8_I2C_SCK
1V8_I2C2_SDA: R193.2 ; port 1V8_I2C_SDA
1V8_I2S1_DIN: J14.12 ; port 1V8_I2S_SDIN
1V8_I2S1_DOUT: J14.14 ; port 1V8_I2S_DOUT
1V8_I2S1_FS: J14.10 ; port 1V8_I2S_LRCK
1V8_I2S1_SCLK: J14.8 ; port 1V8_I2S_SCLK
1V8_UART0_CTS: J14.34 ; port 1V8_UART_CTS
1V8_UART0_RTS: J14.36 ; port 1V8_UART_RTS
1V8_UART0_RXD: J14.22 ; port 1V8_UART_RXD
1V8_UART0_TXD: J14.32 ; port 1V8_UART_TXD
1V8_W_DISABLE1_CTRL (GPIO05): R197.2 ; port HV_W_DISABLE1
3V3_PCIE0_nWAKE: J14.55 ; port 3V3_WIFI_PCIE_WAKE
3V3_PCIE1_CLKREQ: J14.53 ; port 3V3_WIFI_PCIE_CLKREQ
3V3_PCIE1_nRST: J14.52 ; port 3V3_nWIFI_PCIE_RST
M2_nWIFI_SDIO_RST: J14.23
M2_nWIFI_SDIO_WAKE: J14.21
M2_WIFI_AP_WAKE_BT: J14.42 U21.4(Y)
M2_WIFI_COEX1: J14.48
M2_WIFI_COEX2: J14.46
M2_WIFI_COEX3: J14.44
M2_WIFI_nLED1: J14.6
M2_WIFI_nLED2: J14.16
M2_WIFI_nW_DISABLE1: J14.56 Q29.6(Drain1) R194.1
M2_WIFI_nW_DISABLE2: J14.54 Q29.3(Drain2) R199.1
M2_WIFI_SDIO_CLK: J14.9
M2_WIFI_SDIO_CMD: J14.11
M2_WIFI_SDIO_D0: J14.13
M2_WIFI_SDIO_D1: J14.15
M2_WIFI_SDIO_D2: J14.17
M2_WIFI_SDIO_D3: J14.19
M2_WIFI_SMB_nALERT: J14.62 R196.1 TP14.1(TP)
M2_WIFI_SMB_SCL: J14.60 R195.1 TP13.1(TP)
M2_WIFI_SMB_SDA: J14.58 R193.1 TP12.1(TP)
M2_WIFI_VENDOR_DEFINED_2: J14.40
M2_WIFI_VENDOR_DEFINED_3: J14.38
nWIFI_M2_ALERT: R196.2 ; port 1V8_nALERT
PCIE1_CLK_N: J14.47 ; port WIFI_PCIE_CLK_P
PCIE1_CLK_P: J14.49 ; port WIFI_PCIE_CLK_N
PCIE1_RX0_N: J14.41 ; port WIFI_PCIE_RX0_P
PCIE1_RX0_P: J14.43 ; port WIFI_PCIE_RX0_N
PCIE1_TX0_N: C192.1 ; port WIFI_PCIE_TX0_N
PCIE1_TX0_P: C191.1 ; port WIFI_PCIE_TX0_P
USB2_2_N: J14.5 ; port USB2_N
USB2_2_P: J14.3 ; port USB2_P
WIFI_PCIE_TX0_N: C192.2 J14.37
WIFI_PCIE_TX0_P: C191.2 J14.35
NetJ14_20: J14.20 R192.1
NetJ14_50: J14.50 ; port 3V3_SUSCLK_IN
NetQ29_2: Q29.2(Gate1) R197.1 R198.2
NetQ29_5: Q29.5(Gate2) R200.1 R201.2
NetU21_2: U21.2(A) ; port 1V8_AP_WAKE_BT

Not connected (* = marked no-connect by the designer): J14 59* 61* 64* 65* 66* 67* 68* 70* 71* 73*

### Layout directives
differential pair; differential pair class 85DIFF: WIFI_PCIE_TX0_N, WIFI_PCIE_TX0_P

### Notes on the sheet
- M.2 KEY E CONNECTOR
- WAKE BUFFER
- (near R192) 1V8 PULLUP IN JETSON SCHEMATIC
- Note for nUART_WAKE:
  On p.20 of ref schematics, this pin is pulled to 3V3 but seems wrong so pulling to 1V8 instead and added jumper in M2_WiFi schematic
- Ref design connects M2_WIFI_AP_WAKE_BT to a buffer but the buffer's input is left NC so I'm leaving this pin NC
- LEVEL SHIFTERS
- PULLUP IN JETSON SCHEMATIC
- (near J14) PULLUP IN JETSON SCHEMATIC
- SMB TPs
- MECH
- UNLABELLED RESISTORS ARE 0402 JUMPERS
- Schematics Checked - Dec 04 2025
  - Schematics match p.20 of ref schematics
  - Pin levels confirmed with https://pinoutguide.com/HD/M.2_NGFF_connector_pinout.shtml

### Library data of the parts
C186-C188 C190-C195 = CMP-001-00058-1: as C231-C233 on sheet JETSON_V2; Min Operating Temperature: -55°C; Mounting Technology: Surface Mount; Pins: 2; Case/Package: 0402; RoHS Compliant: Yes; Max Operating Temperature: 85°C
C189 C196 = CMP-2006-02792-2: as C234 on sheet JETSON_V2; Packaging: Tape and Reel; Voltage Rating (DC): 6.3V; Width: 0.031inch; Termination: SMD/SMT; Dielectric: X5R; Package Quantity: 4000; Voltage Rating: 6.3V; Capacitance: 10uF; Case/Package: 0603; Min Operating Temperature: -55°C; Voltage: 6.3V; Length: 1.6mm; Thickness: 0.035inch; Lead Free: Lead Free; Depth: 0.8mm; Case Code (Imperial): 0603; Max Operating Temperature: 85°C; Material: Ceramic; Height: 0.8mm; Tolerance: 20%; Mount: Surface Mount; REACH SVHC: No SVHC; Radiation Hardening: No; Case Code (Metric): 1608
J14 = CMP-03365-000002-1: CONN FEMALE 67POS 0.020 GOLD; Manufacturer: TE Connectivity; Conn Orientation: Right Angle; Pitch: 0.5mm; Number Of Contacts: 67; Voltage Rating: 50V; Is Female: yes; Current Rating: 0.5A; Lead Free: Yes; Temperature Range Low: -40°C; Device Class L3: unset; Package: 0; Manufacturer Part Number: 2199230-4; RoHS: TRUE; Digikey Description: CONN FEMALE 67POS 0.020 GOLD; Category: Conn; Device Class L1: Connectors; Temperature Range High: +80°C; ComponentLink2Description: Datasheet; ComponentLink2URL: https://www.te.com/commerce/DocumentDelivery/DDEController?Action=showdoc&DocId=Customer+Drawing%7F2199230%7FB3%7Fpdf%7FEnglish%7FENG_CD_2199230_B3.pdf%7F2199230-4; Mouser Description: PCI Express / PCI Connectors .5PITCH 4.2H KEY E EMBOSS NGFF MINICARD; Automotive: No; Conn Gender: Female; Height: 4.2mm; Device Class L2: Card Edge Connectors; Contact Material: Gold,Nickel; Number Of Rows: 2; Octopart: https://octopart.com/2199230-4-te+connectivity-46436156; Temperature: -40°C to +80°C
MP2 = CMP-03913-59774857-1: as MP3 on sheet JETSON_V2; REACH SVHC: Unknown; NexarPartId: 59774857; RoHS: Compliant; Material: Steel; Packaging: Tape and Reel; Max Operating Temperature: 150°C; Min Operating Temperature: -55°C; Length: 2.5mm; Height: 2.5mm
Q29 = CMP-013-00023-2: as Q32 on sheet JETSON_V2; Max Operating Temperature: 150°C; Min Operating Temperature: -55°C
R192 R193 R195 R196 = CMP-009-00118-2: READ THE NAME; Pins: 2; Component Type: Standard; Design Item ID: CMP-009-00206-2; Source: 0402jump.SchLib
R194 R197-R201 = CMP-009-00002-14: Resistor
TP12-TP14 = CMP-00025-2: Test Point .6mm
U21 = CMP-2000-06816-1: as U27 on sheet JETSON_V2; Manufacturer URL: https://www.fairchildsemi.com/; Mounting: SurfaceMount; Number of Channels per Chip: 1; Package Description: 5-Pin Small Outline Transistor, Body 2.9 x 1.6 mm, Pitch 0.95 mm; Package Reference: SOT23-5; Number of Elements per Chip: 1; Package URL: https://www.fairchildsemi.com/package-drawings/MA/MA05B.pdf; Datasheet URL: https://www.fairchildsemi.com/datasheets/NC/NC7SZ125.pdf; Datasheet Version: Rev. 1.0.5, 01/2014; Mounting Technology: SurfaceMount; Operating Temperature: -40to85C; Number of Inputs per Chip: 1